# Altium project ECU.PrjPCB
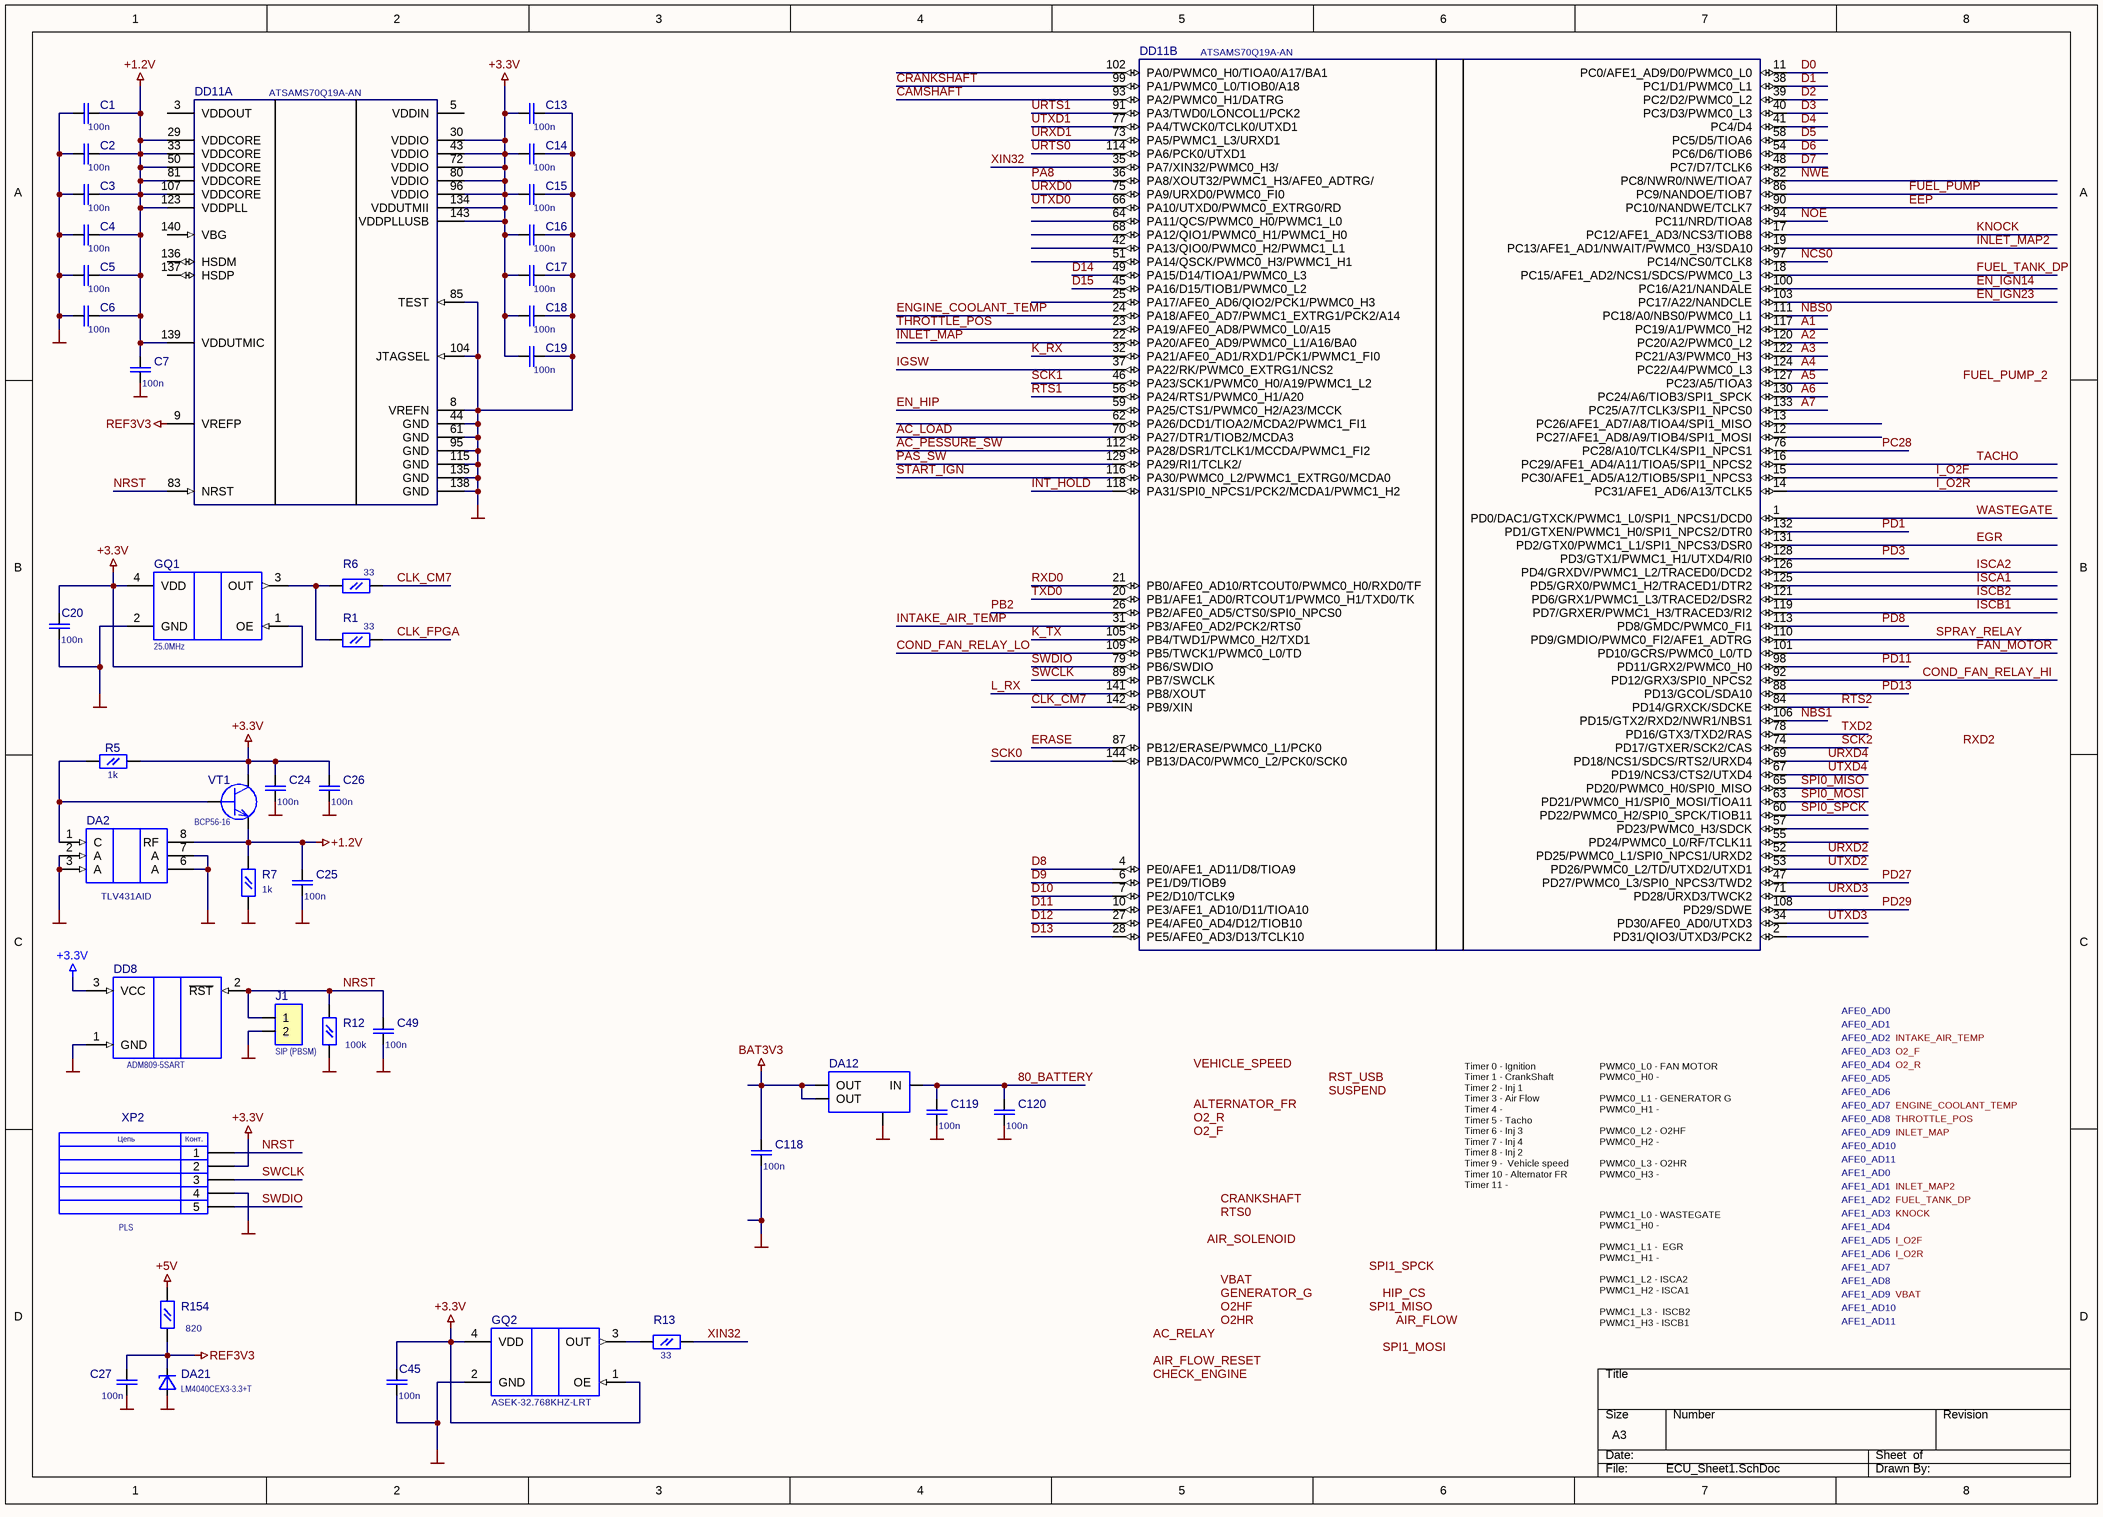
[diagram p0: ECU_Sheet1.SchDoc]
6 sheets, 338 parts. Net scope: global (net labels, ports and power ports of the same name join across sheets).
Board file: ECU.PcbDoc
Sheets:
  ECU_Sheet1.SchDoc
  ECU_Sheet2.SchDoc
  ECU_Sheet3.SchDoc
  ECU_Sheet4.SchDoc
  ECU_Sheet5.SchDoc
  ECU_Sheet6.SchDoc

## Sheet ECU_Sheet1.SchDoc
size A3

### Parts
C1  value 100n  [C0603L]  (hidden comment: 0.1мкФ-25В-X8R-10%)
C2  value 100n  [C0603L]  (hidden comment: 0.1мкФ-25В-X8R-10%)
C3  value 100n  [C0603L]  (hidden comment: 0.1мкФ-25В-X8R-10%)
C4  value 100n  [C0603L]  (hidden comment: 0.1мкФ-25В-X8R-10%)
C5  value 100n  [C0603L]  (hidden comment: 0.1мкФ-25В-X8R-10%)
C6  value 100n  [C0603L]  (hidden comment: 0.1мкФ-25В-X8R-10%)
C7  value 100n  [C0603L]  (hidden comment: 0.1мкФ-25В-X8R-10%)
C13  value 100n  [C0603L]  (hidden comment: 0.1мкФ-25В-X8R-10%)
C14  value 100n  [C0603L]  (hidden comment: 0.1мкФ-25В-X8R-10%)
C15  value 100n  [C0603L]  (hidden comment: 0.1мкФ-25В-X8R-10%)
C16  value 100n  [C0603L]  (hidden comment: 0.1мкФ-25В-X8R-10%)
C17  value 100n  [C0603L]  (hidden comment: 0.1мкФ-25В-X8R-10%)
C18  value 100n  [C0603L]  (hidden comment: 0.1мкФ-25В-X8R-10%)
C19  value 100n  [C0603L]  (hidden comment: 0.1мкФ-25В-X8R-10%)
C20  value 100n  [C0805L]  (hidden comment: 0.01мкФ-50В-X8R-10%)
C24  value 100n  [C0805L]  (hidden comment: 0.1мкФ-25В-X8R-10%)
C25  value 100n  [C0805L]  (hidden comment: 0.1мкФ-25В-X8R-10%)
C26  value 100n  [C0805L]  (hidden comment: 0.1мкФ-25В-X8R-10%)
C27  value 100n  [C0603L]  (hidden comment: 0.1мкФ-25В-X8R-10%)
C45  value 100n  [C0805L]  (hidden comment: 0.01мкФ-50В-X8R-10%)
C49  value 100n  [C0603L]  (hidden comment: 0.1мкФ-25В-X8R-10%)
C118  value 100n  [C0805L]  (hidden comment: 0.1мкФ-25В-X8R-10%)
C119  value 100n  [C0805L]  (hidden comment: CSMD)
C120  value 100n  [C0805L]  (hidden comment: CSMD)
DA2  TLV431AID  [SOIC8 JEDEC]
DA12  LM1117IMP-3.3  [SOT-223]  (value not drawn)
DA21  LM4040CEX3-3.3+T  [SOT-23]
DD8  ADM809-5SART  [SOT-23]
DD11  ATSAMS70Q19A-AN  [LQFP144]  (parts A,B of 2)
GQ1  25.0MHz  [KXO-97]
GQ2  ASEK-32.768KHZ-LRT  [QUARTZ-3.2mm-2.5mm]
J1  SIP (PBSM)  [SIP1X2S]
R1  value 33  [R0603L]  (hidden comment: 33-5%)
R5  value 1k  [R0805]  (hidden comment: 1к-5%)
R6  value 33  [R0603L]  (hidden comment: 33-5%)
R7  value 1k  [R0805L]  (hidden comment: 1к-5%)
R12  value 100k  [R0805L]  (hidden comment: 100к-5%)
R13  value 33  [R0603L]  (hidden comment: 33-5%)
R154  value 820  [R0805L]  (hidden comment: 100к-5%)
VT1  BCP56-16  [SOT-223 PWR]
XP2  PLS  [SIP5]

### Nets
+1.2V: C1.1 C2.1 C3.1 C4.1 C5.1 C6.1 C7.1 C25.1 DA2.8(RF) DD11.29(VDDCORE) DD11.33(VDDCORE) DD11.50(VDDCORE) DD11.81(VDDCORE) DD11.107(VDDCORE) DD11.123(VDDPLL) DD11.139(VDDUTMIC) R7.2(Pin2) VT1.3(E)
+3.3V: C13.2 C14.2 C15.2 C16.2 C17.2 C18.2 C19.2 C20.2 C24.1 C26.1 C45.2 DD8.3(VCC) DD11.30(VDDIO) DD11.43(VDDIO) DD11.72(VDDIO) DD11.80(VDDIO) DD11.96(VDDIO) DD11.134(VDDUTMII) DD11.143(VDDPLLUSB) GQ1.1(OE) GQ1.4(VDD) GQ2.1(OE) GQ2.4(VDD) R5.1(Pin1) VT1.2(C) XP2.2
+5V: R154.2(Pin2)
BAT3V3: C118.1 DA12.2(OUT) DA12.4(OUT)
GND: C1.2 C2.2 C3.2 C4.2 C5.2 C6.2 C7.2 C13.1 C14.1 C15.1 C16.1 C17.1 C18.1 C19.1 C20.1 C24.2 C25.2 C26.2 C27.2 C45.1 C49.2 C118.2 C119.2 C120.2 DA2.2(A) DA2.3(A) DA2.6(A) DA2.7(A) DA12.1(G) DA21.2 DD8.1(GND) DD11.8(VREFN) DD11.44(GND) DD11.61(GND) DD11.85(TEST) DD11.95(GND) DD11.104(JTAGSEL) DD11.115(GND) DD11.135(GND) DD11.138(GND) GQ1.2(GND) GQ2.2(GND) J1.2 R7.1(Pin1) R12.1(Pin1) XP2.4
REF3V3: C27.1 DA21.1 DD11.9(VREFP) R154.1(Pin1)
80_BATTERY: C119.1 C120.1 DA12.3(IN)
A1: DD11.117(PC19/A1/PWMC0_H2)
A2: DD11.120(PC20/A2/PWMC0_L2)
A3: DD11.122(PC21/A3/PWMC0_H3)
A4: DD11.124(PC22/A4/PWMC0_L3)
A5: DD11.127(PC23/A5/TIOA3)
A6: DD11.130(PC24/A6/TIOB3/SPI1_SPCK)
A7: DD11.133(PC25/A7/TCLK3/SPI1_NPCS0)
AC_LOAD: DD11.70(PA27/DTR1/TIOB2/MCDA3)
AC_PESSURE_SW: DD11.112(PA28/DSR1/TCLK1/MCCDA/PWMC1_FI2)
CAMSHAFT: DD11.93(PA2/PWMC0_H1/DATRG)
CLK_CM7: DD11.142(PB9/XIN) R6.2(Pin2)
CLK_FPGA: R1.2(Pin2)
COND_FAN_RELAY_HI: DD11.92(PD12/GRX3/SPI0_NPCS2)
COND_FAN_RELAY_LO: DD11.109(PB5/TWCK1/PWMC0_L0/TD)
CRANKSHAFT: DD11.99(PA1/PWMC0_L0/TIOB0/A18)
D0: DD11.11(PC0/AFE1_AD9/D0/PWMC0_L0)
D1: DD11.38(PC1/D1/PWMC0_L1)
D2: DD11.39(PC2/D2/PWMC0_L2)
D3: DD11.40(PC3/D3/PWMC0_L3)
D4: DD11.41(PC4/D4)
D5: DD11.58(PC5/D5/TIOA6)
D6: DD11.54(PC6/D6/TIOB6)
D7: DD11.48(PC7/D7/TCLK6)
D8: DD11.4(PE0/AFE1_AD11/D8/TIOA9)
D9: DD11.6(PE1/D9/TIOB9)
D10: DD11.7(PE2/D10/TCLK9)
D11: DD11.10(PE3/AFE1_AD10/D11/TIOA10)
D12: DD11.27(PE4/AFE0_AD4/D12/TIOB10)
D13: DD11.28(PE5/AFE0_AD3/D13/TCLK10)
D14: DD11.49(PA15/D14/TIOA1/PWMC0_L3)
D15: DD11.45(PA16/D15/TIOB1/PWMC0_L2)
EEP: DD11.90(PC10/NANDWE/TCLK7)
EGR: DD11.131(PD2/GTX0/PWMC1_L1/SPI1_NPCS3/DSR0)
EN_HIP: DD11.59(PA25/CTS1/PWMC0_H2/A23/MCCK)
EN_IGN14: DD11.100(PC16/A21/NANDALE)
EN_IGN23: DD11.103(PC17/A22/NANDCLE)
ENGINE_COOLANT_TEMP: DD11.24(PA18/AFE0_AD7/PWMC1_EXTRG1/PCK2/A14)
ERASE: DD11.87(PB12/ERASE/PWMC0_L1/PCK0)
FAN_MOTOR: DD11.101(PD10/GCRS/PWMC0_L0/TD)
FUEL_PUMP: DD11.86(PC9/NANDOE/TIOB7)
FUEL_TANK_DP: DD11.18(PC15/AFE1_AD2/NCS1/SDCS/PWMC0_L3)
I_O2F: DD11.15(PC30/AFE1_AD5/A12/TIOB5/SPI1_NPCS3)
I_O2R: DD11.14(PC31/AFE1_AD6/A13/TCLK5)
IGSW: DD11.37(PA22/RK/PWMC0_EXTRG1/NCS2)
INLET_MAP: DD11.22(PA20/AFE0_AD9/PWMC0_L1/A16/BA0)
INLET_MAP2: DD11.19(PC13/AFE1_AD1/NWAIT/PWMC0_H3/SDA10)
INT_HOLD: DD11.118(PA31/SPI0_NPCS1/PCK2/MCDA1/PWMC1_H2)
INTAKE_AIR_TEMP: DD11.31(PB3/AFE0_AD2/PCK2/RTS0)
ISCA1: DD11.125(PD5/GRX0/PWMC1_H2/TRACED1/DTR2)
ISCA2: DD11.126(PD4/GRXDV/PWMC1_L2/TRACED0/DCD2)
ISCB1: DD11.119(PD7/GRXER/PWMC1_H3/TRACED3/RI2)
ISCB2: DD11.121(PD6/GRX1/PWMC1_L3/TRACED2/DSR2)
K_RX: DD11.32(PA21/AFE0_AD1/RXD1/PCK1/PWMC1_FI0)
K_TX: DD11.105(PB4/TWD1/PWMC0_H2/TXD1)
KNOCK: DD11.17(PC12/AFE1_AD3/NCS3/TIOB8)
L_RX: DD11.141(PB8/XOUT)
NBS0: DD11.111(PC18/A0/NBS0/PWMC0_L1)
NBS1: DD11.106(PD15/GTX2/RXD2/NWR1/NBS1)
NCS0: DD11.97(PC14/NCS0/TCLK8)
NOE: DD11.94(PC11/NRD/TIOA8)
NRST: C49.1 DD8.2(~{RST}) DD11.83(NRST) J1.1 R12.2(Pin2) XP2.1
NWE: DD11.82(PC8/NWR0/NWE/TIOA7)
PA8: DD11.36(PA8/XOUT32/PWMC1_H3/AFE0_ADTRG/)
PAS_SW: DD11.129(PA29/RI1/TCLK2/)
PB2: DD11.26(PB2/AFE0_AD5/CTS0/SPI0_NPCS0)
PC28: DD11.76(PC28/A10/TCLK4/SPI1_NPCS1)
PD1: DD11.132(PD1/GTXEN/PWMC1_H0/SPI1_NPCS2/DTR0)
PD3: DD11.128(PD3/GTX1/PWMC1_H1/UTXD4/RI0)
PD8: DD11.113(PD8/GMDC/PWMC0_FI1)
PD11: DD11.98(PD11/GRX2/PWMC0_H0)
PD13: DD11.88(PD13/GCOL/SDA10)
PD27: DD11.47(PD27/PWMC0_L3/SPI0_NPCS3/TWD2)
PD29: DD11.108(PD29/SDWE)
RTS1: DD11.56(PA24/RTS1/PWMC0_H1/A20)
RTS2: DD11.84(PD14/GRXCK/SDCKE)
RXD0: DD11.21(PB0/AFE0_AD10/RTCOUT0/PWMC0_H0/RXD0/TF)
SCK0: DD11.144(PB13/DAC0/PWMC0_L2/PCK0/SCK0)
SCK1: DD11.46(PA23/SCK1/PWMC0_H0/A19/PWMC1_L2)
SCK2: DD11.74(PD17/GTXER/SCK2/CAS)
SPI0_MISO: DD11.65(PD20/PWMC0_H0/SPI0_MISO)
SPI0_MOSI: DD11.63(PD21/PWMC0_H1/SPI0_MOSI/TIOA11)
SPI0_SPCK: DD11.60(PD22/PWMC0_H2/SPI0_SPCK/TIOB11)
SPRAY_RELAY: DD11.110(PD9/GMDIO/PWMC0_FI2/AFE1_ADTRG)
START_IGN: DD11.116(PA30/PWMC0_L2/PWMC1_EXTRG0/MCDA0)
SWCLK: DD11.89(PB7/SWCLK) XP2.3
SWDIO: DD11.79(PB6/SWDIO) XP2.5
TACHO: DD11.16(PC29/AFE1_AD4/A11/TIOA5/SPI1_NPCS2)
THROTTLE_POS: DD11.23(PA19/AFE0_AD8/PWMC0_L0/A15)
TXD0: DD11.20(PB1/AFE1_AD0/RTCOUT1/PWMC0_H1/TXD0/TK)
TXD2: DD11.78(PD16/GTX3/TXD2/RAS)
URTS0: DD11.114(PA6/PCK0/UTXD1)
URTS1: DD11.91(PA3/TWD0/LONCOL1/PCK2)
URXD0: DD11.75(PA9/URXD0/PWMC0_FI0)
URXD1: DD11.73(PA5/PWMC1_L3/URXD1)
URXD2: DD11.52(PD25/PWMC0_L1/SPI0_NPCS1/URXD2)
URXD3: DD11.71(PD28/URXD3/TWCK2)
URXD4: DD11.69(PD18/NCS1/SDCS/RTS2/URXD4)
UTXD0: DD11.66(PA10/UTXD0/PWMC0_EXTRG0/RD)
UTXD1: DD11.77(PA4/TWCK0/TCLK0/UTXD1)
UTXD2: DD11.53(PD26/PWMC0_L2/TD/UTXD2/UTXD1)
UTXD3: DD11.34(PD30/AFE0_AD0/UTXD3)
UTXD4: DD11.67(PD19/NCS3/CTS2/UTXD4)
WASTEGATE: DD11.1(PD0/DAC1/GTXCK/PWMC1_L0/SPI1_NPCS1/DCD0)
XIN32: DD11.35(PA7/XIN32/PWMC0_H3/) R13.2(Pin2)
NetDA2_1: DA2.1(C) R5.2(Pin2) VT1.1(B)
NetGQ1_3: GQ1.3(OUT) R1.1(Pin1) R6.1(Pin1)
NetGQ2_3: GQ2.3(OUT) R13.1(Pin1)

Not connected (* = marked no-connect by the designer): DD11 2(PD31/QIO3/UTXD3/PCK2) 3(VDDOUT) 5(VDDIN) 12(PC27/AFE1_AD8/A9/TIOB4/SPI1_MOSI) 13(PC26/AFE1_AD7/A8/TIOA4/SPI1_MISO) 25(PA17/AFE0_AD6/QIO2/PCK1/PWMC0_H3) 42(PA13/QIO0/PWMC0_H2/PWMC1_L1) 51(PA14/QSCK/PWMC0_H3/PWMC1_H1) 55(PD24/PWMC0_L0/RF/TCLK11) 57(PD23/PWMC0_H3/SDCK) 62(PA26/DCD1/TIOA2/MCDA2/PWMC1_FI1) 64(PA11/QCS/PWMC0_H0/PWMC1_L0) 68(PA12/QIO1/PWMC0_H1/PWMC1_H0) 102(PA0/PWMC0_H0/TIOA0/A17/BA1) 136(HSDM) 137(HSDP) 140(VBG)

### Notes on the sheet
- AFE0_AD0
- AFE0_AD1
- AFE0_AD2
- AFE0_AD3
- AFE0_AD4
- AFE0_AD5
- AFE0_AD6
- AFE0_AD7
- AFE0_AD8
- Timer 0 - Ignition
  Timer 1 - CrankShaft
  Timer 2 - Inj 1
  Timer 3 - Air Flow
  Timer 4 -
  Timer 5 - Tacho
  Timer 6 - Inj 3
  Timer 7 - Inj 4
  Timer 8 - Inj 2
  Timer 9 -  Vehicle speed
  Timer 10 - Alternator FR
  Timer 11 -
- PWMC0_L0 - FAN MOTOR
  PWMC0_H0 -
  PWMC0_L1 - GENERATOR G
  PWMC0_H1 -
  PWMC0_L2 - O2HF
  PWMC0_H2 -
  PWMC0_L3 - O2HR
  PWMC0_H3 -
- AFE0_AD9
- AFE0_AD10
- AFE0_AD11
- AFE1_AD0
- AFE1_AD1
- AFE1_AD2
- AFE1_AD3
- AFE1_AD4
- AFE1_AD5
- AFE1_AD6
- AFE1_AD7
- AFE1_AD8
- AFE1_AD9
- AFE1_AD10
- AFE1_AD11
- PWMC1_L0 - WASTEGATE
  PWMC1_H0 -
  PWMC1_L1 -  EGR
  PWMC1_H1 -
  PWMC1_L2 - ISCA2
  PWMC1_H2 - ISCA1
  PWMC1_L3 -  ISCB2
  PWMC1_H3 - ISCB1
- Labels drawn without touching a wire or pin: AC_RELAY, AIR_FLOW, AIR_FLOW_RESET, AIR_SOLENOID, ALTERNATOR_FR, CHECK_ENGINE, CRANKSHAFT, ENGINE_COOLANT_TEMP, FUEL_PUMP_2, FUEL_TANK_DP, GENERATOR_G, HIP_CS, I_O2F, I_O2R, INLET_MAP, INLET_MAP2, INTAKE_AIR_TEMP, KNOCK, O2_F, O2_R, O2HF, O2HR, RST_USB, RTS0, RXD2, SPI1_MISO, SPI1_MOSI, SPI1_SPCK, SUSPEND, THROTTLE_POS, VBAT, VEHICLE_SPEED
- (in symbol CONNSIP5) Цепь; Конт.

### Library data of the parts
C1-C7 C13-C20 C24-C27 C45 C49 C118-C120 = CSMD: C0603; Voltage: *; Part Field 1: *; Part Field 2: *
DA2 = TL431AID
DA21 = LM4040: Improved Precision Micropower Shunt Voltage Reference
GQ1 = KXO-V97T: KXO-V97T 25.0 MHz; Part Field 1: KXО-V97
GQ2 = ASEMB-8.000MHZ-LY
J1 = CON2: Part Field 2: 2 конт.
R1 R6 R12 R13 R154 = RSMD: R0805; Part Field 1: *; Part Field 2: *
R5 R7 = RSMD: R0805; Part Field 1: 0603; Part Field 2: *
XP2 = CONNSIP5: Value: *; Part Field 2: 5 конт.
DA12 = LM1117IMP-3.3: Value: *
VT1 = BCP56-16: Value: *

## Sheet ECU_Sheet2.SchDoc
size A3
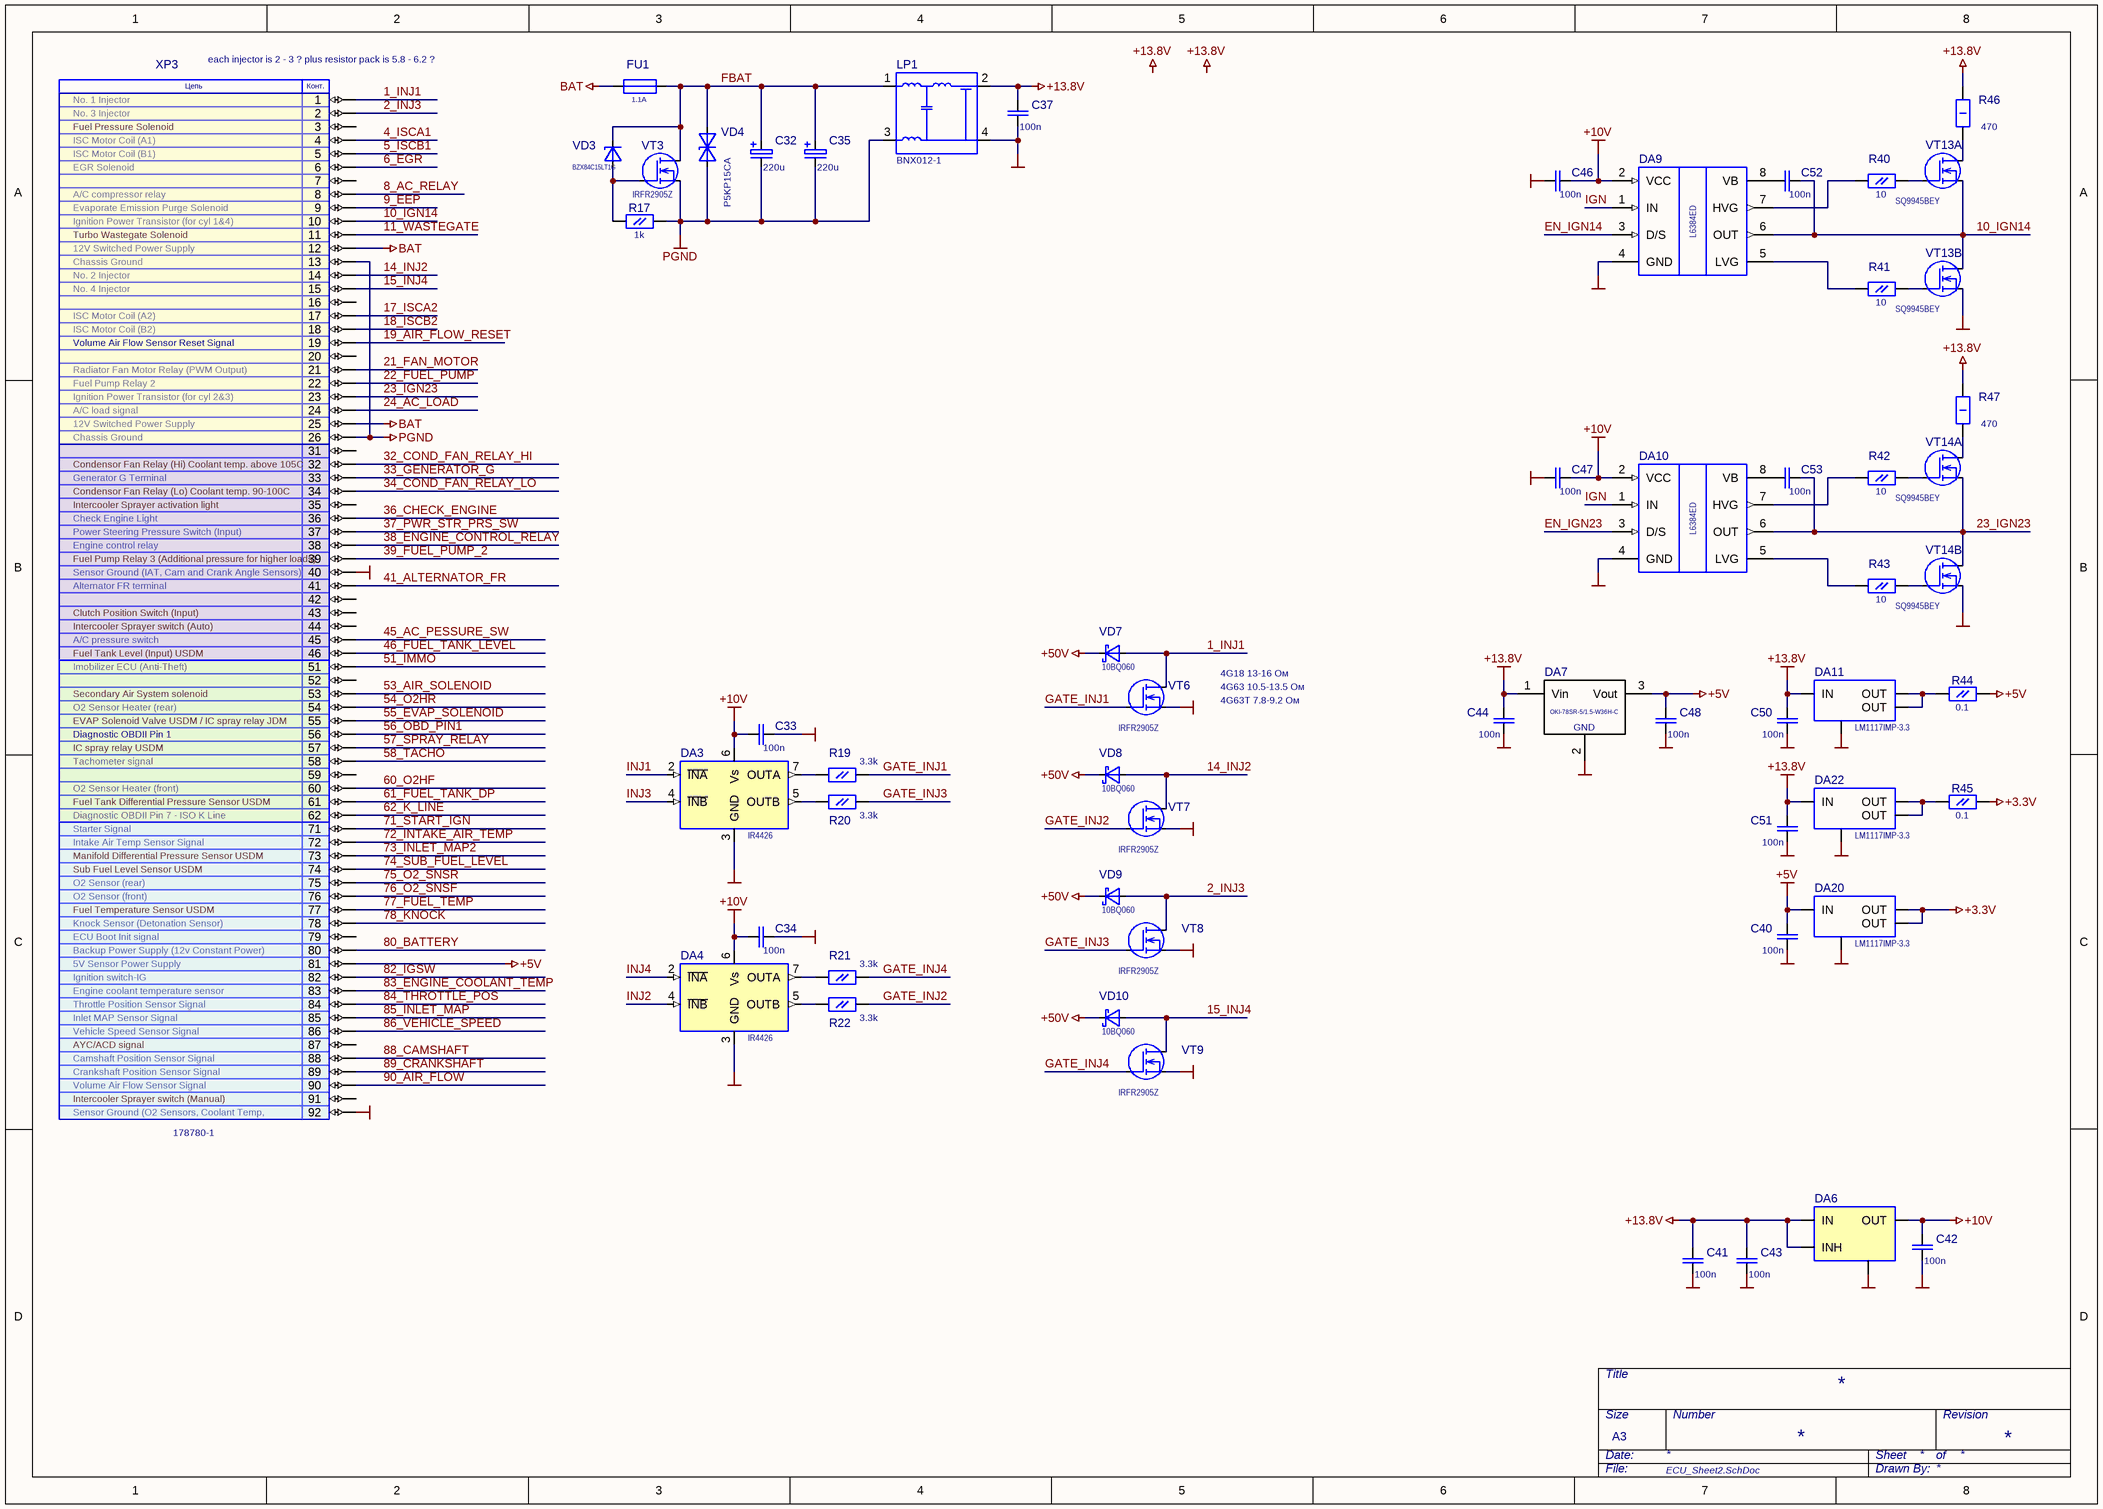
[diagram p1: ECU_Sheet2.SchDoc]

### Parts
C32  value 220u  [C_D_POL]  (hidden comment: CTANT)
C33  value 100n  [C0805L]  (hidden comment: CSMD)
C34  value 100n  [C0805L]  (hidden comment: CSMD)
C35  value 220u  [C_D_POL]  (hidden comment: CTANT)
C37  value 100n  [C0805L]  (hidden comment: 0.1мкФ-25В-X8R-10%)
C40  value 100n  [C0805L]  (hidden comment: CSMD)
C41  value 100n  [C0805L]  (hidden comment: 0.1мкФ-25В-X8R-10%)
C42  value 100n  [C0805L]  (hidden comment: 0.1мкФ-25В-X8R-10%)
C43  value 100n  [C0805L]  (hidden comment: 0.1мкФ-25В-X8R-10%)
C44  value 100n  [C0805L]  (hidden comment: CSMD)
C46  value 100n  [C0805L]  (hidden comment: CSMD)
C47  value 100n  [C0805L]  (hidden comment: CSMD)
C48  value 100n  [C0805L]  (hidden comment: CSMD)
C50  value 100n  [C0805L]  (hidden comment: CSMD)
C51  value 100n  [C0805L]  (hidden comment: CSMD)
C52  value 100n  [C0805L]  (hidden comment: CSMD)
C53  value 100n  [C0805L]  (hidden comment: CSMD)
DA3  IR4426  [SOIC8 JEDEC]
DA4  IR4426  [SOIC8 JEDEC]
DA6  TLE4266GS V10  [SOT-223]  (value not drawn)
DA7  OKI-78SR-5/1.5-W36H-C  [OKI-78SR-H]
DA9  L6384ED  [SOIC8 JEDEC]
DA10  L6384ED  [SOIC8 JEDEC]
DA11  LM1117IMP-3.3  [SOT-223]
DA20  LM1117IMP-3.3  [SOT-223]
DA22  LM1117IMP-3.3  [SOT-223]
FU1  value 1.1A  [FUSE1206]  (hidden comment: MF-NSMF110)
LP1  BNX012-1  [BNX012-01]
R17  value 1k  [R0805L]  (hidden comment: 1к-5%)
R19  value 3.3k  [R0603L]  (hidden comment: RSMD)
R20  value 3.3k  [R0603L]  (hidden comment: RSMD)
R21  value 3.3k  [R0603L]  (hidden comment: RSMD)
R22  value 3.3k  [R0603L]  (hidden comment: RSMD)
R40  value 10  [R0603L]  (hidden comment: RSMD)
R41  value 10  [R0603L]  (hidden comment: RSMD)
R42  value 10  [R0603L]  (hidden comment: RSMD)
R43  value 10  [R0603L]  (hidden comment: RSMD)
R44  value 0.1  [R0805L]  (hidden comment: 1к-5%)
R45  value 0.1  [R0805L]  (hidden comment: 1к-5%)
R46  value 470  [R2512]  (hidden comment: R2512)
R47  value 470  [R2512]  (hidden comment: R2512)
VD3  BZX84C15LT1G  [SOT-23]
VD4  P5KP15CA  [P600]
VD7  10BQ060  [DO-214AA SMB]
VD8  10BQ060  [DO-214AA SMB]
VD9  10BQ060  [DO-214AA SMB]
VD10  10BQ060  [DO-214AA SMB]
VT3  IRFR2905Z  [D-PAK (TO-252)]
VT6  IRFR2905Z  [D-PAK (TO-252)]
VT7  IRFR2905Z  [D-PAK (TO-252)]
VT8  IRFR2905Z  [D-PAK (TO-252)]
VT9  IRFR2905Z  [D-PAK (TO-252)]
VT13  SQ9945BEY  [SOIC8 DBL FET]  (parts A,B of 2)
VT14  SQ9945BEY  [SOIC8 DBL FET]  (parts A,B of 2)
XP3  178780-1  [MITSUBISHI_ECU_CON]

### Nets
+3.3V: DA20.2(OUT) DA20.4(OUT) R45.1(Pin1)
+5V: C40.1 C48.1 DA7.3(Vout) DA20.3(IN) R44.1(Pin1) XP3.81
+10V: C33.2 C34.2 C42.1 C46.1 C47.1 DA3.6(Vs) DA4.6(Vs) DA6.3(OUT) DA9.2(VCC) DA10.2(VCC)
+13.8V: C37.1 C41.1 C43.1 C44.1 C50.1 C51.1 DA6.1(IN) DA6.2(INH) DA7.1(Vin) DA11.3(IN) DA22.3(IN) LP1.2(CB) R46.2(Pin2) R47.2(Pin2)
+50V: VD7.2 VD8.2 VD9.2 VD10.2
BAT: FU1.1 XP3.12 XP3.25
GND: C33.1 C34.1 C37.2 C40.2 C41.2 C42.2 C43.2 C44.2 C46.2 C47.2 C48.2 C50.2 C51.2 DA3.3(GND) DA4.3(GND) DA6.4(GND) DA7.2 DA9.4(GND) DA10.4(GND) DA11.1(G) DA20.1(G) DA22.1(G) LP1.4(CG) VT6.2(S) VT7.2(S) VT8.2(S) VT9.2(S) VT13.3 VT14.3 XP3.40 XP3.92
PGND: C32.N C35.N LP1.3(PSG) R17.1(Pin1) VD4.1 VT3.2(S) XP3.13 XP3.26
1_INJ1: VD7.1 VT6.3(D) XP3.1
2_INJ3: VD9.1 VT8.3(D) XP3.2
4_ISCA1: XP3.4
5_ISCB1: XP3.5
6_EGR: XP3.6
8_AC_RELAY: XP3.8
9_EEP: XP3.9
10_IGN14: C52.1 DA9.6(OUT) VT13.1 VT13.5 XP3.10
11_WASTEGATE: XP3.11
14_INJ2: VD8.1 VT7.3(D) XP3.14
15_INJ4: VD10.1 VT9.3(D) XP3.15
17_ISCA2: XP3.17
18_ISCB2: XP3.18
19_AIR_FLOW_RESET: XP3.19
21_FAN_MOTOR: XP3.21
22_FUEL_PUMP: XP3.22
23_IGN23: C53.1 DA10.6(OUT) VT14.1 VT14.5 XP3.23
24_AC_LOAD: XP3.24
32_COND_FAN_RELAY_HI: XP3.32
33_GENERATOR_G: XP3.33
34_COND_FAN_RELAY_LO: XP3.34
36_CHECK_ENGINE: XP3.36
37_PWR_STR_PRS_SW: XP3.37
38_ENGINE_CONTROL_RELAY: XP3.38
39_FUEL_PUMP_2: XP3.39
41_ALTERNATOR_FR: XP3.41
45_AC_PESSURE_SW: XP3.45
46_FUEL_TANK_LEVEL: XP3.46
51_IMMO: XP3.51
53_AIR_SOLENOID: XP3.53
54_O2HR: XP3.54
55_EVAP_SOLENOID: XP3.55
56_OBD_PIN1: XP3.56
57_SPRAY_RELAY: XP3.57
58_TACHO: XP3.58
60_O2HF: XP3.60
61_FUEL_TANK_DP: XP3.61
62_K_LINE: XP3.62
71_START_IGN: XP3.71
72_INTAKE_AIR_TEMP: XP3.72
73_INLET_MAP2: XP3.73
74_SUB_FUEL_LEVEL: XP3.74
75_O2_SNSR: XP3.75
76_O2_SNSF: XP3.76
77_FUEL_TEMP: XP3.77
78_KNOCK: XP3.78
80_BATTERY: XP3.80
82_IGSW: XP3.82
83_ENGINE_COOLANT_TEMP: XP3.83
84_THROTTLE_POS: XP3.84
85_INLET_MAP: XP3.85
86_VEHICLE_SPEED: XP3.86
88_CAMSHAFT: XP3.88
89_CRANKSHAFT: XP3.89
90_AIR_FLOW: XP3.90
EN_IGN14: DA9.3(D/S)
EN_IGN23: DA10.3(D/S)
FBAT: C32.P C35.P FU1.2 LP1.1(B) VD3.3 VD4.2 VT3.3(D)
GATE_INJ1: R19.2(Pin2) VT6.1(G)
GATE_INJ2: R22.2(Pin2) VT7.1(G)
GATE_INJ3: R20.2(Pin2) VT8.1(G)
GATE_INJ4: R21.2(Pin2) VT9.1(G)
IGN: DA9.1(IN) DA10.1(IN)
INJ1: DA3.2(~{INA})
INJ2: DA4.4(~{INB})
INJ3: DA3.4(~{INB})
INJ4: DA4.2(~{INA})
NetC52_2: C52.2 DA9.8(VB)
NetC53_2: C53.2 DA10.8(VB)
NetDA3_5: DA3.5(OUTB) R20.1(Pin1)
NetDA3_7: DA3.7(OUTA) R19.1(Pin1)
NetDA4_5: DA4.5(OUTB) R22.1(Pin1)
NetDA4_7: DA4.7(OUTA) R21.1(Pin1)
NetDA9_5: DA9.5(LVG) R41.1(Pin1)
NetDA9_7: DA9.7(HVG) R40.1(Pin1)
NetDA10_5: DA10.5(LVG) R43.1(Pin1)
NetDA10_7: DA10.7(HVG) R42.1(Pin1)
NetDA11_2: DA11.2(OUT) DA11.4(OUT) R44.2(Pin2)
NetDA22_2: DA22.2(OUT) DA22.4(OUT) R45.2(Pin2)
NetR17_2: R17.2(Pin2) VD3.1 VT3.1(G)
NetR40_2: R40.2(Pin2) VT13.2
NetR41_2: R41.2(Pin2) VT13.4
NetR42_2: R42.2(Pin2) VT14.2
NetR43_2: R43.2(Pin2) VT14.4
NetR46_1: R46.1(Pin1) VT13.6
NetR47_1: R47.1(Pin1) VT14.6

Not connected (* = marked no-connect by the designer): LP1 5 6; XP3 3 7 16 20 31 35 42 43 44 52 59 79 87 91

### Notes on the sheet
- No. 1 Injector
- No. 3 Injector
- (near XP3) each injector is 2 - 3 ? plus resistor pack is 5.8 - 6.2 ?
- ISC Motor Coil (A1)
- ISC Motor Coil (B1)
- EGR Solenoid
- Fuel Pressure Solenoid
- A/C compressor relay
- Evaporate Emission Purge Solenoid
- Ignition Power Transistor (for cyl 1&4)
- 12V Switched Power Supply
- Turbo Wastegate Solenoid
- No. 2 Injector
- No. 4 Injector
- ISC Motor Coil (A2)
- Chassis Ground
- ISC Motor Coil (B2)
- Radiator Fan Motor Relay (PWM Output)
- Fuel Pump Relay 2
- Volume Air Flow Sensor Reset Signal
- Ignition Power Transistor (for cyl 2&3)
- A/C load signal
- Generator G Terminal
- Check Engine Light
- Intercooler Sprayer activation light
- (near XP3) Condensor Fan Relay (Lo) Coolant temp. 90-100C
- (near XP3) Condensor Fan Relay (Hi) Coolant temp. above 105C
- Power Steering Pressure Switch (Input)
- Engine control relay
- (near XP3) Sensor Ground (IAT, Cam and Crank Angle Sensors)
- Alternator FR terminal
- (near XP3) Fuel Pump Relay 3 (Additional pressure for higher loads)
- A/C pressure switch
- Fuel Tank Level (Input) USDM
- Intercooler Sprayer switch (Auto)
- Clutch Position Switch (Input)
- Imobilizer ECU (Anti-Theft)
- O2 Sensor Heater (rear)
- (near XP3) EVAP Solenoid Valve USDM / IC spray relay JDM
- Secondary Air System solenoid
- 4G18 13-16 Ом
- 4G63T 7.8-9.2 Ом
- 4G63 10.5-13.5 Ом
- Tachometer signal
- O2 Sensor Heater (front)
- Diagnostic OBDII Pin 1
- IC spray relay USDM
- Diagnostic OBDII Pin 7 - ISO K Line
- Starter Signal
- Intake Air Temp Sensor Signal
- (near XP3) Manifold Differential Pressure Sensor USDM
- (near XP3) Fuel Tank Differential Pressure Sensor USDM
- O2 Sensor (rear)
- O2 Sensor (front)
- Knock Sensor (Detonation Sensor)
- Fuel Temperature Sensor USDM
- Sub Fuel Level Sensor USDM
- ECU Boot Init signal
- Backup Power Supply (12v Constant Power)
- 5V Sensor Power Supply
- Ignition switch-IG
- Engine coolant temperature sensor
- Throttle Position Sensor Signal
- Inlet MAP Sensor Signal
- Vehicle Speed Sensor Signal
- Camshaft Position Sensor Signal
- AYC/ACD signal
- Volume Air Flow Sensor Signal
- Crankshaft Position Sensor Signal
- Sensor Ground (O2 Sensors, Coolant Temp,
- Intercooler Sprayer switch (Manual)
- Labels drawn without touching a wire or pin: +13.8V
- Title
- Date:
- Size
- A3
- Number
- Sheet
- of
- Revision
- File:
- Drawn By:
- (in symbol MITSUBISHI_ECU_CON) Цепь; Конт.
- (in symbol OKI-78SR) GND

### Library data of the parts
C32 C35 = CTANT: 220 mkF  25 v (корпус Е (4,4х7мм))  20% smd   Танталовый    ЧИП    227M025V; Part Field 1: *; Part Field 2: *
C33 C34 C37 C40-C44 C46-C48 C50-C53 = CSMD: C0603; Voltage: *; Part Field 1: *; Part Field 2: *
DA6 = TLE4266G: Value: *
DA7 = OKI-78SR: Fixed Output 1.5 Amp SIP DC/DC Converter
FU1 = MF-NSMF012
R17 R44 R45 = RSMD: R0805; Part Field 1: 0603; Part Field 2: *
R19-R22 R40-R43 = RSMD: R0805; Part Field 1: *; Part Field 2: *
VD3 = BZX84C36: Value: *
VT3 VT6-VT9 = SPD02N80C3: MOSFET 55V , 42A , 0.011 Om; OriginalName: 2N4124; ComponentField6: Published 8-Jun-2000, Modified 11-July-2000: SIM Model Added.; Value: *
XP3 = MITSUBISHI_ECU_CON: TE 178780-1; Value: *
DA3 DA4 = IR4426: Part Field 1: *; Part Field 2: *
DA11 DA20 DA22 = LM1117IMP-3.3: Value: *
LP1 = BNX012-1: Value: *
VD7-VD10 = 10BQ060: Value: *

## Sheet ECU_Sheet3.SchDoc
size A3
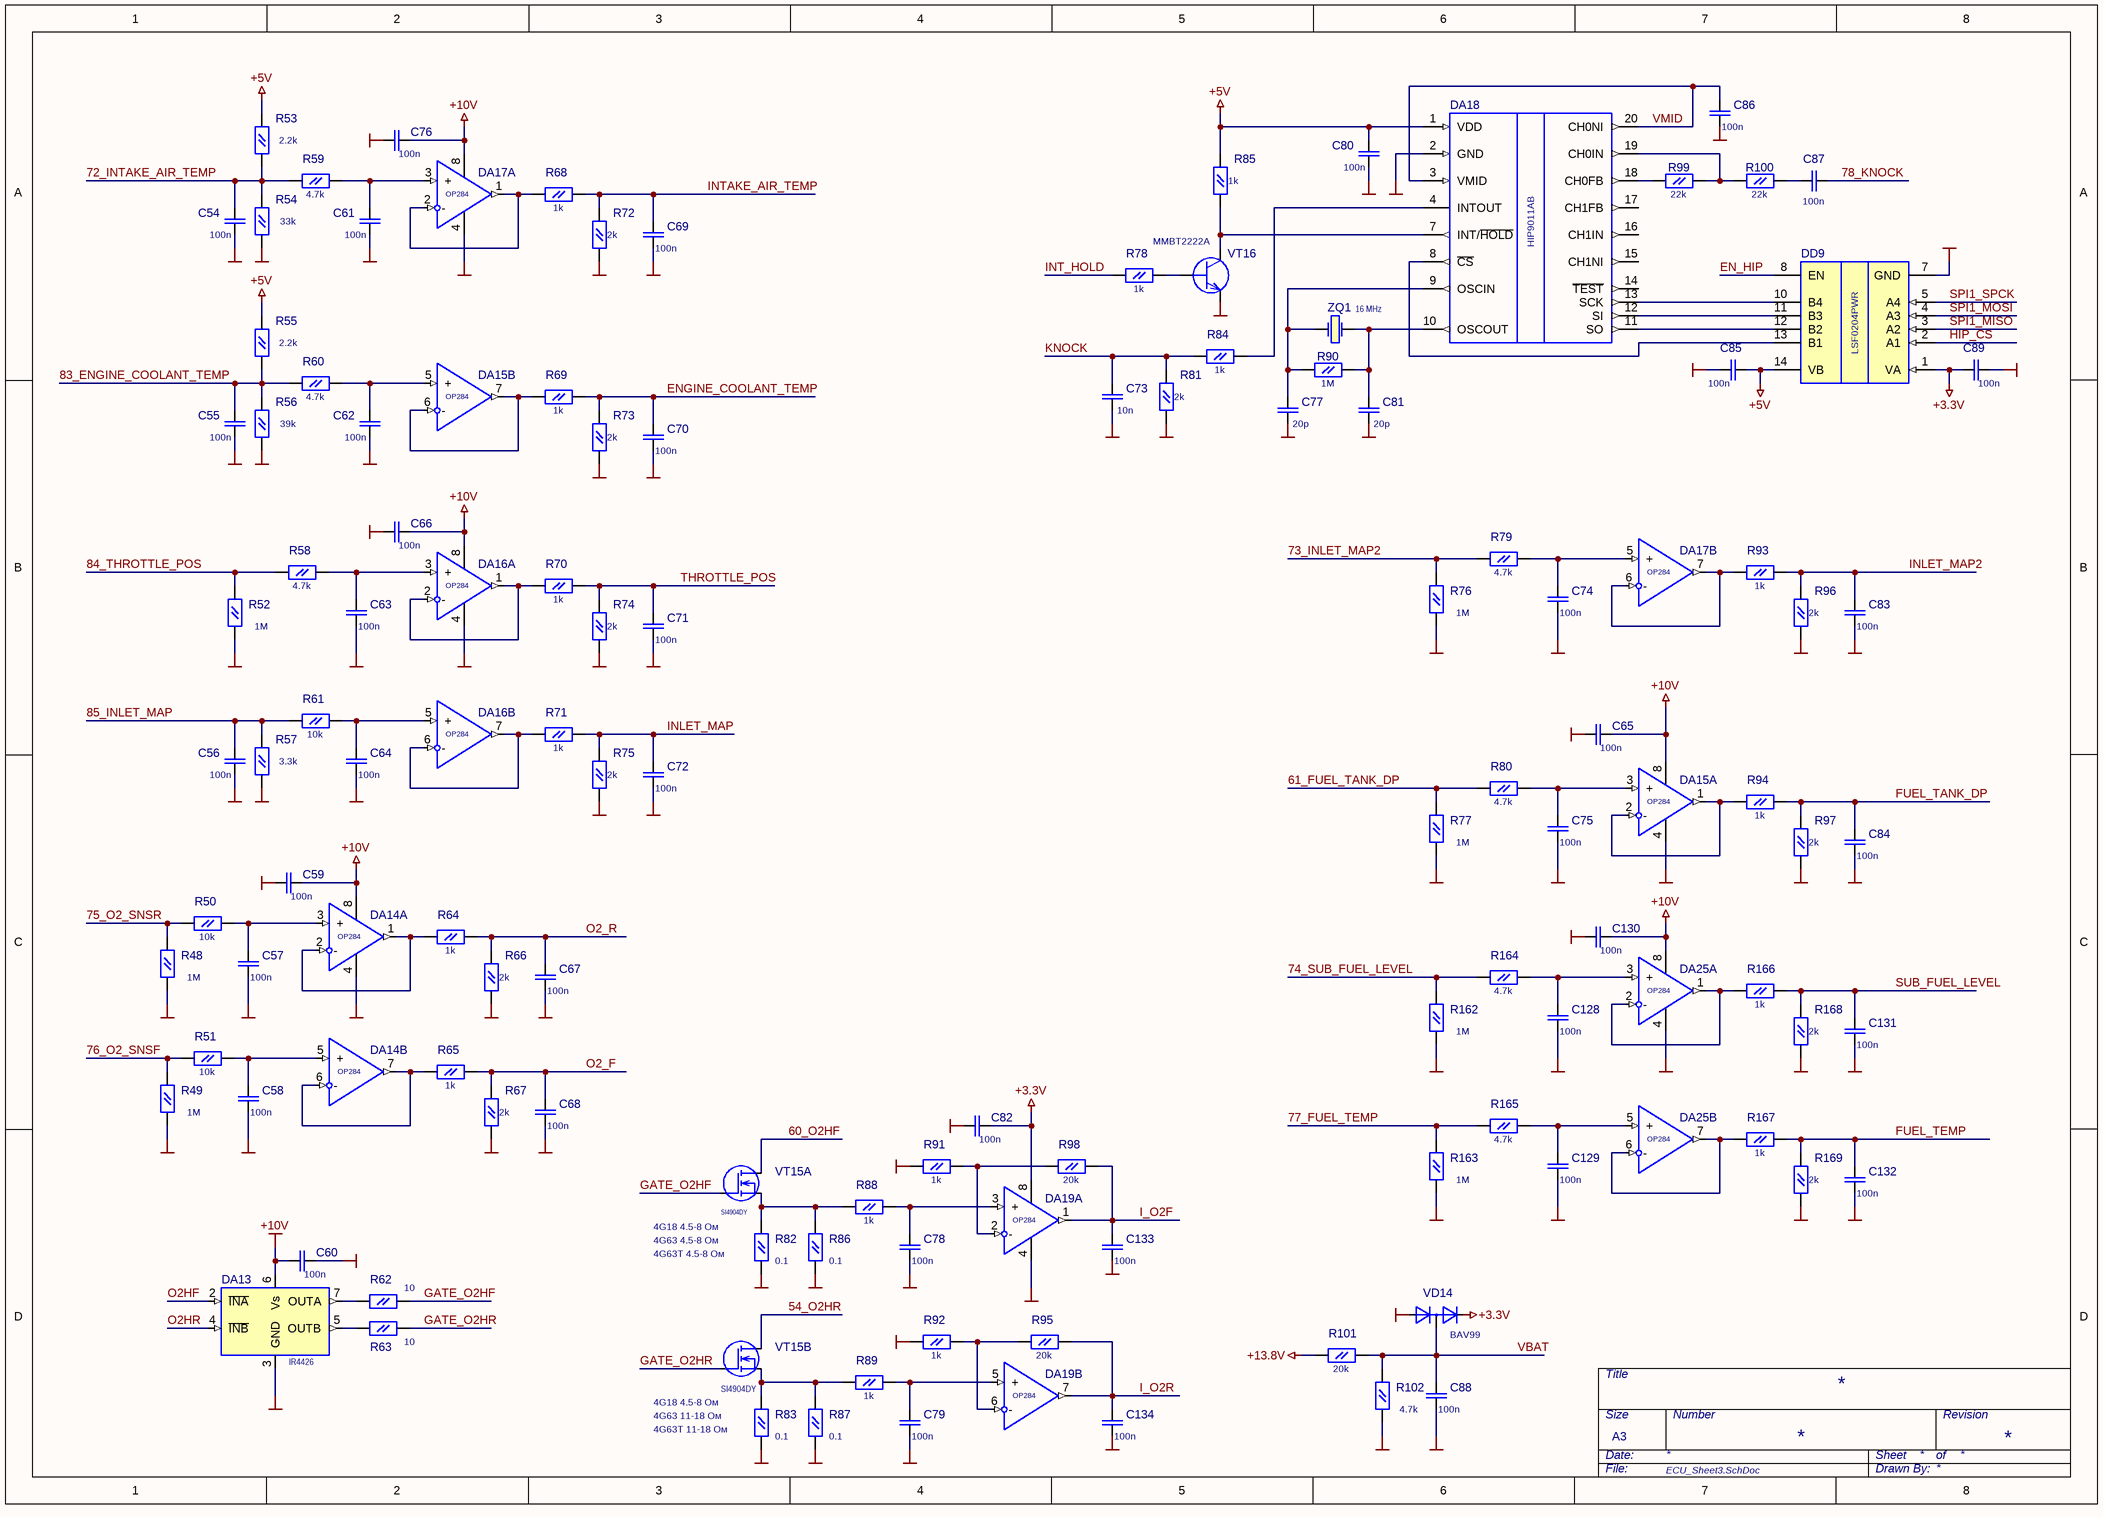
[diagram p2: ECU_Sheet3.SchDoc]

### Parts
C54  value 100n  [C0805L]  (hidden comment: CSMD)
C55  value 100n  [C0805L]  (hidden comment: CSMD)
C56  value 100n  [C0805L]  (hidden comment: CSMD)
C57  value 100n  [C0805L]  (hidden comment: CSMD)
C58  value 100n  [C0805L]  (hidden comment: CSMD)
C59  value 100n  [C0805L]  (hidden comment: CSMD)
C60  value 100n  [C0805L]  (hidden comment: CSMD)
C61  value 100n  [C0805L]  (hidden comment: CSMD)
C62  value 100n  [C0805L]  (hidden comment: CSMD)
C63  value 100n  [C0805L]  (hidden comment: CSMD)
C64  value 100n  [C0805L]  (hidden comment: CSMD)
C65  value 100n  [C0805L]  (hidden comment: CSMD)
C66  value 100n  [C0805L]  (hidden comment: CSMD)
C67  value 100n  [C0603L]  (hidden comment: CSMD)
C68  value 100n  [C0603L]  (hidden comment: CSMD)
C69  value 100n  [C0603L]  (hidden comment: CSMD)
C70  value 100n  [C0603L]  (hidden comment: CSMD)
C71  value 100n  [C0603L]  (hidden comment: CSMD)
C72  value 100n  [C0603L]  (hidden comment: CSMD)
C73  value 10n  [C0603L]  (hidden comment: CSMD)
C74  value 100n  [C0805L]  (hidden comment: CSMD)
C75  value 100n  [C0805L]  (hidden comment: CSMD)
C76  value 100n  [C0805L]  (hidden comment: CSMD)
C77  value 20p  [C0805L]  (hidden comment: CSMD)
C78  value 100n  [C0805L]  (hidden comment: CSMD)
C79  value 100n  [C0805L]  (hidden comment: CSMD)
C80  value 100n  [C0805L]  (hidden comment: CSMD)
C81  value 20p  [C0805L]  (hidden comment: CSMD)
C82  value 100n  [C0805L]  (hidden comment: CSMD)
C83  value 100n  [C0603L]  (hidden comment: CSMD)
C84  value 100n  [C0603L]  (hidden comment: CSMD)
C85  value 100n  [C0805L]  (hidden comment: CSMD)
C86  value 100n  [C0805L]  (hidden comment: CSMD)
C87  value 100n  [C0805L]  (hidden comment: CSMD)
C88  value 100n  [C0603L]  (hidden comment: CSMD)
C89  value 100n  [C0805L]  (hidden comment: CSMD)
C128  value 100n  [C0805L]  (hidden comment: CSMD)
C129  value 100n  [C0805L]  (hidden comment: CSMD)
C130  value 100n  [C0805L]  (hidden comment: CSMD)
C131  value 100n  [C0603L]  (hidden comment: CSMD)
C132  value 100n  [C0603L]  (hidden comment: CSMD)
C133  value 100n  [C0603L]  (hidden comment: CSMD)
C134  value 100n  [C0603L]  (hidden comment: CSMD)
DA13  IR4426  [SOIC8 JEDEC]
DA14  OP284  [SOIC8 JEDEC]  (parts A,B of 2)
DA15  OP284  [SOIC8 JEDEC]  (parts A,B of 2)
DA16  OP284  [SOIC8 JEDEC]  (parts A,B of 2)
DA17  OP284  [SOIC8 JEDEC]  (parts A,B of 2)
DA18  HIP9011AB  [SOIC-20 (JEDEC MS-013-AC)]
DA19  OP284  [SOIC8 JEDEC]  (parts A,B of 2)
DA25  OP284  [SOIC8 JEDEC]  (parts A,B of 2)
DD9  LSF0204PWR  [TSSOP14 (JEDEC MO-153)]
R48  value 1M  [R0805L]  (hidden comment: RSMD)
R49  value 1M  [R0805L]  (hidden comment: RSMD)
R50  value 10k  [R0805L]  (hidden comment: RSMD)
R51  value 10k  [R0805L]  (hidden comment: RSMD)
R52  value 1M  [R0805L]  (hidden comment: RSMD)
R53  value 2.2k  [R0805L]  (hidden comment: RSMD)
R54  value 33k  [R0805L]  (hidden comment: RSMD)
R55  value 2.2k  [R0805L]  (hidden comment: RSMD)
R56  value 39k  [R0805L]  (hidden comment: RSMD)
R57  value 3.3k  [R0805L]  (hidden comment: RSMD)
R58  value 4.7k  [R0805L]  (hidden comment: RSMD)
R59  value 4.7k  [R0805L]  (hidden comment: RSMD)
R60  value 4.7k  [R0805L]  (hidden comment: RSMD)
R61  value 10k  [R0805L]  (hidden comment: RSMD)
R62  value 10  [R0603L]  (hidden comment: RSMD)
R63  value 10  [R0603L]  (hidden comment: RSMD)
R64  value 1k  [R0805L]  (hidden comment: RSMD)
R65  value 1k  [R0805L]  (hidden comment: RSMD)
R66  value 2k  [R0805L]  (hidden comment: RSMD)
R67  value 2k  [R0805L]  (hidden comment: RSMD)
R68  value 1k  [R0805L]  (hidden comment: RSMD)
R69  value 1k  [R0805L]  (hidden comment: RSMD)
R70  value 1k  [R0805L]  (hidden comment: RSMD)
R71  value 1k  [R0805L]  (hidden comment: RSMD)
R72  value 2k  [R0805L]  (hidden comment: RSMD)
R73  value 2k  [R0805L]  (hidden comment: RSMD)
R74  value 2k  [R0805L]  (hidden comment: RSMD)
R75  value 2k  [R0805L]  (hidden comment: RSMD)
R76  value 1M  [R0805L]  (hidden comment: RSMD)
R77  value 1M  [R0805L]  (hidden comment: RSMD)
R78  value 1k  [R0805L]  (hidden comment: RSMD)
R79  value 4.7k  [R0805L]  (hidden comment: RSMD)
R80  value 4.7k  [R0805L]  (hidden comment: RSMD)
R81  value 2k  [R0805L]  (hidden comment: RSMD)
R82  value 0.1  [R0805L]  (hidden comment: RSMD)
R83  value 0.1  [R0805L]  (hidden comment: RSMD)
R84  value 1k  [R0805L]  (hidden comment: RSMD)
R85  value 1k  [R0805L]  (hidden comment: RSMD)
R86  value 0.1  [R0805L]  (hidden comment: RSMD)
R87  value 0.1  [R0805L]  (hidden comment: RSMD)
R88  value 1k  [R0805L]  (hidden comment: RSMD)
R89  value 1k  [R0805L]  (hidden comment: RSMD)
R90  value 1M  [R0805L]  (hidden comment: RSMD)
R91  value 1k  [R0805L]  (hidden comment: RSMD)
R92  value 1k  [R0805L]  (hidden comment: RSMD)
R93  value 1k  [R0805L]  (hidden comment: RSMD)
R94  value 1k  [R0805L]  (hidden comment: RSMD)
R95  value 20k  [R0805L]  (hidden comment: RSMD)
R96  value 2k  [R0805L]  (hidden comment: RSMD)
R97  value 2k  [R0805L]  (hidden comment: RSMD)
R98  value 20k  [R0805L]  (hidden comment: RSMD)
R99  value 22k  [R0805L]  (hidden comment: RSMD)
R100  value 22k  [R0805L]  (hidden comment: RSMD)
R101  value 20k  [R0805L]  (hidden comment: RSMD)
R102  value 4.7k  [R0805L]  (hidden comment: RSMD)
R162  value 1M  [R0805L]  (hidden comment: RSMD)
R163  value 1M  [R0805L]  (hidden comment: RSMD)
R164  value 4.7k  [R0805L]  (hidden comment: RSMD)
R165  value 4.7k  [R0805L]  (hidden comment: RSMD)
R166  value 1k  [R0805L]  (hidden comment: RSMD)
R167  value 1k  [R0805L]  (hidden comment: RSMD)
R168  value 2k  [R0805L]  (hidden comment: RSMD)
R169  value 2k  [R0805L]  (hidden comment: RSMD)
VD14  BAV99  [SOT-23]
VT15  SI4904DY  [SOIC8 DBL FET]  (parts A,B of 2)
VT16  MMBT2222A  [SOT-23_MMBT2222A(Primary)]
ZQ1  16 MHz  [HC-49/S]

### Nets
+3.3V: C82.1 C89.2 DA19.8(V+) DD9.1(VA) VD14.2(K)
+5V: C80.2 C85.2 DA18.1(VDD) DD9.14(VB) R53.2(Pin2) R55.2(Pin2) R85.2(Pin2)
+10V: C59.1 C60.2 C65.1 C66.1 C76.1 C130.1 DA13.6(Vs) DA14.8(V+) DA15.8(V+) DA16.8(V+) DA17.8(V+) DA25.8(V+)
+13.8V: R101.1(Pin1)
GND: C54.2 C55.2 C56.2 C57.2 C58.2 C59.2 C60.1 C61.2 C62.2 C63.2 C64.2 C65.2 C66.2 C67.2 C68.2 C69.2 C70.2 C71.2 C72.2 C73.2 C74.2 C75.2 C76.2 C77.2 C78.2 C79.2 C80.1 C81.2 C82.2 C83.2 C84.2 C85.1 C86.2 C88.2 C89.1 C128.2 C129.2 C130.2 C131.2 C132.2 C133.2 C134.2 DA13.3(GND) DA14.4(V-) DA15.4(V-) DA16.4(V-) DA17.4(V-) DA18.2(GND) DA19.4(V-) DA25.4(V-) DD9.7(GND) R48.1(Pin1) R49.1(Pin1) R52.1(Pin1) R54.1(Pin1) R56.1(Pin1) R57.1(Pin1) R66.1(Pin1) R67.1(Pin1) R72.1(Pin1) R73.1(Pin1) R74.1(Pin1) R75.1(Pin1) R76.1(Pin1) R77.1(Pin1) R81.1(Pin1) R82.2(Pin2) R83.2(Pin2) R86.2(Pin2) R87.2(Pin2) R91.1(Pin1) R92.1(Pin1) R96.1(Pin1) R97.1(Pin1) R102.1(Pin1) R162.1(Pin1) R163.1(Pin1) R168.1(Pin1) R169.1(Pin1) VD14.1(A) VT16.3(E)
54_O2HR: VT15.5
60_O2HF: VT15.6
61_FUEL_TANK_DP: R77.2(Pin2) R80.1(Pin1)
72_INTAKE_AIR_TEMP: C54.1 R53.1(Pin1) R54.2(Pin2) R59.1(Pin1)
73_INLET_MAP2: R76.2(Pin2) R79.1(Pin1)
74_SUB_FUEL_LEVEL: R162.2(Pin2) R164.1(Pin1)
75_O2_SNSR: R48.2(Pin2) R50.1(Pin1)
76_O2_SNSF: R49.2(Pin2) R51.1(Pin1)
77_FUEL_TEMP: R163.2(Pin2) R165.1(Pin1)
78_KNOCK: C87.2
83_ENGINE_COOLANT_TEMP: C55.1 R55.1(Pin1) R56.2(Pin2) R60.1(Pin1)
84_THROTTLE_POS: R52.2(Pin2) R58.1(Pin1)
85_INLET_MAP: C56.1 R57.2(Pin2) R61.1(Pin1)
EN_HIP: DD9.8(EN)
ENGINE_COOLANT_TEMP: C70.1 R69.2(Pin2) R73.2(Pin2)
FUEL_TANK_DP: C84.1 R94.2(Pin2) R97.2(Pin2)
FUEL_TEMP: C132.1 R167.2(Pin2) R169.2(Pin2)
GATE_O2HF: R62.2(Pin2) VT15.2
GATE_O2HR: R63.2(Pin2) VT15.4
HIP_CS: DD9.2(A1)
I_O2F: C133.1 DA19.1(OUT) R98.2(Pin2)
I_O2R: C134.1 DA19.7(OUT) R95.2(Pin2)
INLET_MAP: C72.1 R71.2(Pin2) R75.2(Pin2)
INLET_MAP2: C83.1 R93.2(Pin2) R96.2(Pin2)
INT_HOLD: R78.1(Pin1)
INTAKE_AIR_TEMP: C69.1 R68.2(Pin2) R72.2(Pin2)
KNOCK: C73.1 R81.2(Pin2) R84.1(Pin1)
O2_F: C68.1 R65.2(Pin2) R67.2(Pin2)
O2_R: C67.1 R64.2(Pin2) R66.2(Pin2)
O2HF: DA13.2(~{INA})
O2HR: DA13.4(~{INB})
SPI1_MISO: DD9.3(A2)
SPI1_MOSI: DD9.4(A3)
SPI1_SPCK: DD9.5(A4)
SUB_FUEL_LEVEL: C131.1 R166.2(Pin2) R168.2(Pin2)
THROTTLE_POS: C71.1 R70.2(Pin2) R74.2(Pin2)
VBAT: C88.1 R101.2(Pin2) R102.2(Pin2) VD14.3(C)
VMID: C86.1 DA18.3(VMID) DA18.20(CH0NI)
NetC57_1: C57.1 DA14.3(+) R50.2(Pin2)
NetC58_1: C58.1 DA14.5(+) R51.2(Pin2)
NetC61_1: C61.1 DA17.3(+) R59.2(Pin2)
NetC62_1: C62.1 DA15.5(+) R60.2(Pin2)
NetC63_1: C63.1 DA16.3(+) R58.2(Pin2)
NetC64_1: C64.1 DA16.5(+) R61.2(Pin2)
NetC74_1: C74.1 DA17.5(+) R79.2(Pin2)
NetC75_1: C75.1 DA15.3(+) R80.2(Pin2)
NetC77_1: C77.1 DA18.9(OSCIN) R90.1(Pin1) ZQ1.1
NetC78_1: C78.1 DA19.3(+) R88.2(Pin2)
NetC79_1: C79.1 DA19.5(+) R89.2(Pin2)
NetC81_1: C81.1 DA18.10(OSCOUT) R90.2(Pin2) ZQ1.2
NetC87_1: C87.1 R100.2(Pin2)
NetC128_1: C128.1 DA25.3(+) R164.2(Pin2)
NetC129_1: C129.1 DA25.5(+) R165.2(Pin2)
NetDA13_5: DA13.5(OUTB) R63.1(Pin1)
NetDA13_7: DA13.7(OUTA) R62.1(Pin1)
NetDA14_1: DA14.1(OUT) DA14.2(-) R64.1(Pin1)
NetDA14_6: DA14.6(-) DA14.7(OUT) R65.1(Pin1)
NetDA15_1: DA15.1(OUT) DA15.2(-) R94.1(Pin1)
NetDA15_6: DA15.6(-) DA15.7(OUT) R69.1(Pin1)
NetDA16_1: DA16.1(OUT) DA16.2(-) R70.1(Pin1)
NetDA16_6: DA16.6(-) DA16.7(OUT) R71.1(Pin1)
NetDA17_1: DA17.1(OUT) DA17.2(-) R68.1(Pin1)
NetDA17_6: DA17.6(-) DA17.7(OUT) R93.1(Pin1)
NetDA18_4: DA18.4(INTOUT) R84.2(Pin2)
NetDA18_7: DA18.7(INT/~{HOLD}) R85.1(Pin1) VT16.1(C)
NetDA18_8: DA18.8(~{CS}) DD9.13(B1)
NetDA18_11: DA18.11(SO) DD9.12(B2)
NetDA18_12: DA18.12(SI) DD9.11(B3)
NetDA18_13: DA18.13(SCK) DD9.10(B4)
NetDA18_18: DA18.18(CH0FB) R99.1(Pin1)
NetDA18_19: DA18.19(CH0IN) R99.2(Pin2) R100.1(Pin1)
NetDA19_2: DA19.2(-) R91.2(Pin2) R98.1(Pin1)
NetDA19_6: DA19.6(-) R92.2(Pin2) R95.1(Pin1)
NetDA25_1: DA25.1(OUT) DA25.2(-) R166.1(Pin1)
NetDA25_6: DA25.6(-) DA25.7(OUT) R167.1(Pin1)
NetR78_2: R78.2(Pin2) VT16.2(B)
NetR82_1: R82.1(Pin1) R86.1(Pin1) R88.1(Pin1) VT15.1
NetR83_1: R83.1(Pin1) R87.1(Pin1) R89.1(Pin1) VT15.3

Not connected (* = marked no-connect by the designer): DA18 14(~{TEST}) 15(CH1NI) 16(CH1IN) 17(CH1FB)

### Notes on the sheet
- 4G18 4.5-8 Ом
- 4G63 4.5-8 Ом
- 4G63T 4.5-8 Ом
- 4G63 11-18 Ом
- 4G63T 11-18 Ом
- Title
- Date:
- Size
- A3
- Number
- Sheet
- of
- Revision
- File:
- Drawn By:

### Library data of the parts
C54-C89 C128-C134 = CSMD: C0603; Voltage: *; Part Field 1: *; Part Field 2: *
DA14-DA17 DA19 DA25 = AD822: Value: *
R48-R102 R162-R169 = RSMD: R0805
  R62 R63 R82 R83 R86 R87: Part Field 1: *; Part Field 2: *
VT15 = SQ9945BEY: SI4904DY или IRF7341TRPBF или SI4908DY
ZQ1 = QUARZ: KX-3НЕ-16.0 MHz; Part Field 1: HC-49S
DA13 = IR4426: Part Field 1: *; Part Field 2: *
VD14 = BAV99: Value: *
VT16 = MMBT2222A: Value: *

## Sheet ECU_Sheet4.SchDoc
size A3
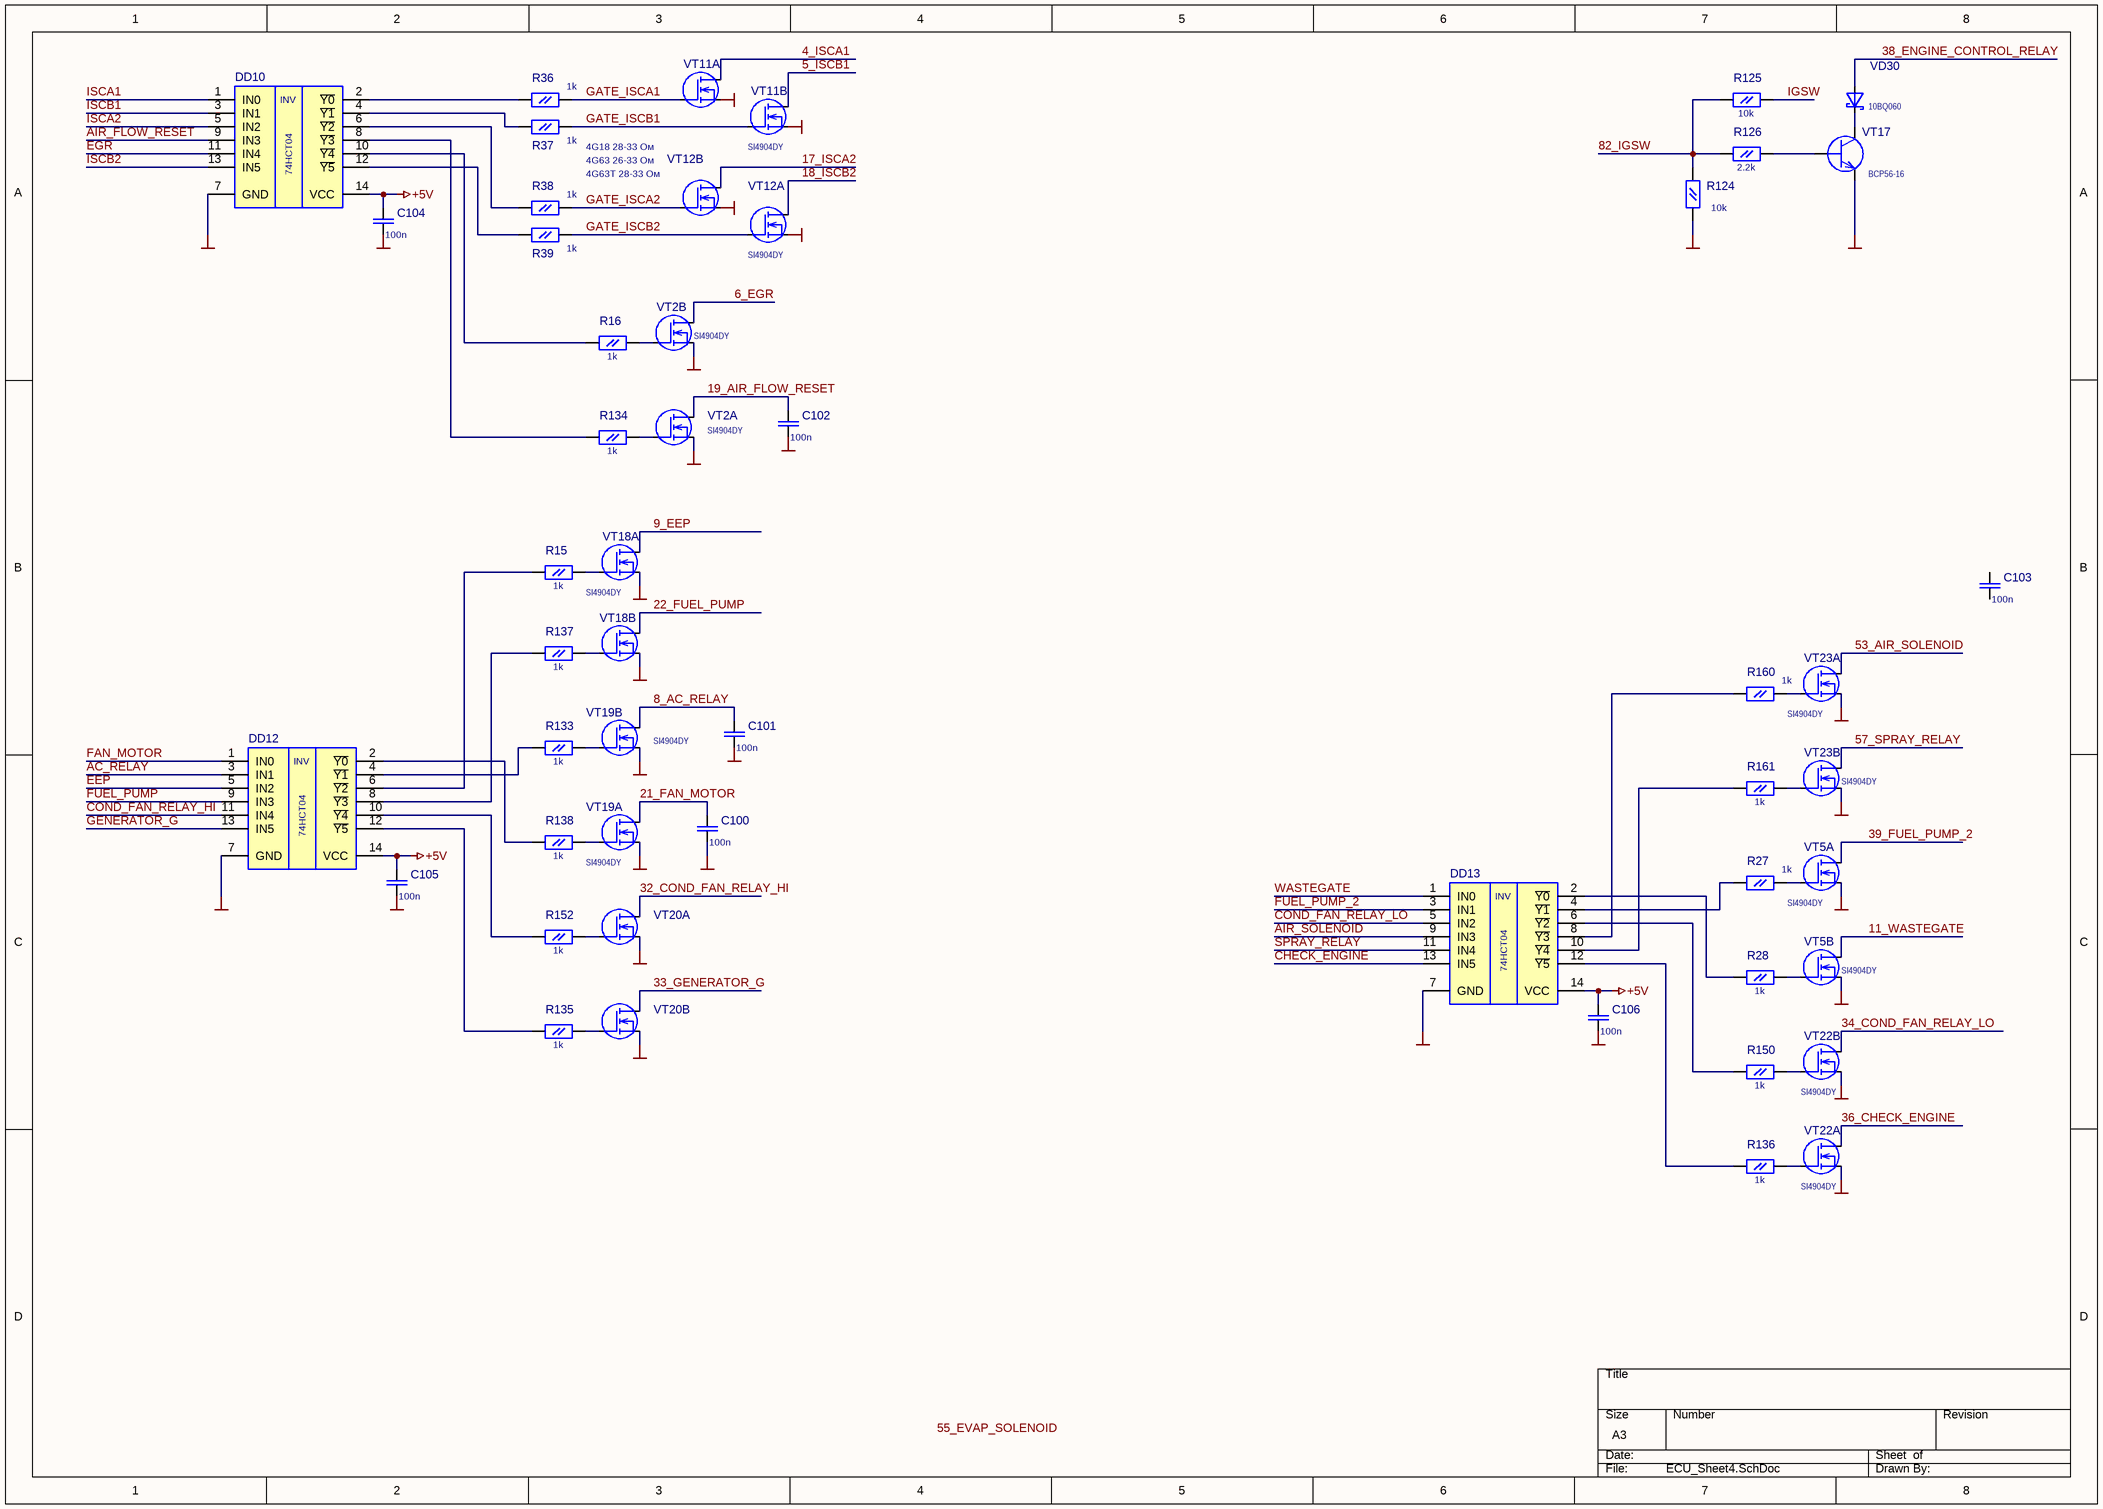
[diagram p3: ECU_Sheet4.SchDoc]

### Parts
C100  value 100n  [C0805L]  (hidden comment: CSMD)
C101  value 100n  [C0805L]  (hidden comment: CSMD)
C102  value 100n  [C0805L]  (hidden comment: CSMD)
C103  value 100n  [C0805L]  (hidden comment: CSMD)
C104  value 100n  [C0805L]  (hidden comment: 0.1мкФ-25В-X8R-10%)
C105  value 100n  [C0805L]  (hidden comment: 0.1мкФ-25В-X8R-10%)
C106  value 100n  [C0805L]  (hidden comment: 0.1мкФ-25В-X8R-10%)
DD10  74HCT04  [TSSOP14 (JEDEC MO-153)]
DD12  74HCT04  [TSSOP14 (JEDEC MO-153)]
DD13  74HCT04  [TSSOP14 (JEDEC MO-153)]
R15  value 1k  [R0805L]  (hidden comment: RSMD)
R16  value 1k  [R0805L]  (hidden comment: RSMD)
R27  value 1k  [R0805L]  (hidden comment: RSMD)
R28  value 1k  [R0805L]  (hidden comment: RSMD)
R36  value 1k  [R0805L]  (hidden comment: RSMD)
R37  value 1k  [R0805L]  (hidden comment: RSMD)
R38  value 1k  [R0805L]  (hidden comment: RSMD)
R39  value 1k  [R0805L]  (hidden comment: RSMD)
R124  value 10k  [R0805L]  (hidden comment: RSMD)
R125  value 10k  [R0805L]  (hidden comment: RSMD)
R126  value 2.2k  [R0805L]  (hidden comment: RSMD)
R133  value 1k  [R0805L]  (hidden comment: RSMD)
R134  value 1k  [R0805L]  (hidden comment: RSMD)
R135  value 1k  [R0805L]  (hidden comment: RSMD)
R136  value 1k  [R0805L]  (hidden comment: RSMD)
R137  value 1k  [R0805L]  (hidden comment: RSMD)
R138  value 1k  [R0805L]  (hidden comment: RSMD)
R150  value 1k  [R0805L]  (hidden comment: RSMD)
R152  value 1k  [R0805L]  (hidden comment: RSMD)
R160  value 1k  [R0805L]  (hidden comment: RSMD)
R161  value 1k  [R0805L]  (hidden comment: RSMD)
VD30  10BQ060  [DO-214AA SMB]
VT2  SI4904DY  [SOIC8 DBL FET]  (parts A,B of 2)
VT5  SI4904DY  [SOIC8 DBL FET]  (parts A,B of 2)
VT11  SI4904DY  [SOIC8 DBL FET]  (value not drawn)  (parts A,B of 2)
VT12  SI4904DY  [SOIC8 DBL FET]  (parts A,B of 2)
VT17  BCP56-16  [SOT-223 PWR]
VT18  SI4904DY  [SOIC8 DBL FET]  (parts A,B of 2)
VT19  SI4904DY  [SOIC8 DBL FET]  (parts A,B of 2)
VT20  SI4904DY  [SOIC8 DBL FET]  (value not drawn)  (parts A,B of 2)
VT22  SI4904DY  [SOIC8 DBL FET]  (parts A,B of 2)
VT23  SI4904DY  [SOIC8 DBL FET]  (parts A,B of 2)

### Nets
+5V: C104.1 C105.1 C106.1 DD10.14(VCC) DD12.14(VCC) DD13.14(VCC)
GND: C100.2 C101.2 C102.2 C104.2 C105.2 C106.2 DD10.7(GND) DD12.7(GND) DD13.7(GND) R124.1(Pin1) VT2.1 VT2.3 VT5.1 VT5.3 VT11.1 VT11.3 VT12.1 VT12.3 VT17.3(E) VT18.1 VT18.3 VT19.1 VT19.3 VT20.1 VT20.3 VT22.1 VT22.3 VT23.1 VT23.3
4_ISCA1: VT11.6
5_ISCB1: VT11.5
6_EGR: VT2.5
8_AC_RELAY: C101.1 VT19.5
9_EEP: VT18.6
11_WASTEGATE: VT5.5
17_ISCA2: VT12.5
18_ISCB2: VT12.6
19_AIR_FLOW_RESET: C102.1 VT2.6
21_FAN_MOTOR: C100.1 VT19.6
22_FUEL_PUMP: VT18.5
32_COND_FAN_RELAY_HI: VT20.6
33_GENERATOR_G: VT20.5
34_COND_FAN_RELAY_LO: VT22.5
36_CHECK_ENGINE: VT22.6
38_ENGINE_CONTROL_RELAY: VD30.1
39_FUEL_PUMP_2: VT5.6
53_AIR_SOLENOID: VT23.6
57_SPRAY_RELAY: VT23.5
82_IGSW: R124.2(Pin2) R125.1(Pin1) R126.1(Pin1)
AC_RELAY: DD12.3(IN1)
AIR_FLOW_RESET: DD10.9(IN3)
AIR_SOLENOID: DD13.9(IN3)
CHECK_ENGINE: DD13.13(IN5)
COND_FAN_RELAY_HI: DD12.11(IN4)
COND_FAN_RELAY_LO: DD13.5(IN2)
EEP: DD12.5(IN2)
EGR: DD10.11(IN4)
FAN_MOTOR: DD12.1(IN0)
FUEL_PUMP: DD12.9(IN3)
FUEL_PUMP_2: DD13.3(IN1)
GATE_ISCA1: R36.2(Pin2) VT11.2
GATE_ISCA2: R38.2(Pin2) VT12.4
GATE_ISCB1: R37.2(Pin2) VT11.4
GATE_ISCB2: R39.2(Pin2) VT12.2
GENERATOR_G: DD12.13(IN5)
IGSW: R125.2(Pin2)
ISCA1: DD10.1(IN0)
ISCA2: DD10.5(IN2)
ISCB1: DD10.3(IN1)
ISCB2: DD10.13(IN5)
SPRAY_RELAY: DD13.11(IN4)
WASTEGATE: DD13.1(IN0)
NetDD10_2: DD10.2(~{Y0}) R36.1(Pin1)
NetDD10_4: DD10.4(~{Y1}) R37.1(Pin1)
NetDD10_6: DD10.6(~{Y2}) R38.1(Pin1)
NetDD10_8: DD10.8(~{Y3}) R134.1(Pin1)
NetDD10_10: DD10.10(~{Y4}) R16.1(Pin1)
NetDD10_12: DD10.12(~{Y5}) R39.1(Pin1)
NetDD12_2: DD12.2(~{Y0}) R138.1(Pin1)
NetDD12_4: DD12.4(~{Y1}) R133.1(Pin1)
NetDD12_6: DD12.6(~{Y2}) R15.1(Pin1)
NetDD12_8: DD12.8(~{Y3}) R137.1(Pin1)
NetDD12_10: DD12.10(~{Y4}) R152.1(Pin1)
NetDD12_12: DD12.12(~{Y5}) R135.1(Pin1)
NetDD13_2: DD13.2(~{Y0}) R28.1(Pin1)
NetDD13_4: DD13.4(~{Y1}) R27.1(Pin1)
NetDD13_6: DD13.6(~{Y2}) R150.1(Pin1)
NetDD13_8: DD13.8(~{Y3}) R160.1(Pin1)
NetDD13_10: DD13.10(~{Y4}) R161.1(Pin1)
NetDD13_12: DD13.12(~{Y5}) R136.1(Pin1)
NetR15_2: R15.2(Pin2) VT18.2
NetR16_2: R16.2(Pin2) VT2.4
NetR27_2: R27.2(Pin2) VT5.2
NetR28_2: R28.2(Pin2) VT5.4
NetR126_2: R126.2(Pin2) VT17.1(B)
NetR133_2: R133.2(Pin2) VT19.4
NetR134_2: R134.2(Pin2) VT2.2
NetR135_2: R135.2(Pin2) VT20.4
NetR136_2: R136.2(Pin2) VT22.2
NetR137_2: R137.2(Pin2) VT18.4
NetR138_2: R138.2(Pin2) VT19.2
NetR150_2: R150.2(Pin2) VT22.4
NetR152_2: R152.2(Pin2) VT20.2
NetR160_2: R160.2(Pin2) VT23.2
NetR161_2: R161.2(Pin2) VT23.4
NetVD30_2: VD30.2 VT17.2(C)

Not connected (* = marked no-connect by the designer): C103 1 2

### Notes on the sheet
- 4G18 28-33 Ом
- 4G63 26-33 Ом
- 4G63T 28-33 Ом
- Labels drawn without touching a wire or pin: 55_EVAP_SOLENOID
- (in symbol 74HCT04) INV

### Library data of the parts
C100-C106 = CSMD: C0603; Voltage: *; Part Field 1: *; Part Field 2: *
R15 R16 R27 R28 R36-R39 R124-R126 R133-R138 R150 R152 R160 R161 = RSMD: R0805
  R15 R16 R27 R28 R36-R39 R137 R138 R160 R161: Part Field 1: *; Part Field 2: *
VT2 VT5 VT11 VT12 VT18-VT20 VT22 VT23 = SQ9945BEY: SI4904DY или IRF7341TRPBF или SI4908DY
DD10 DD12 DD13 = 74HCT04: Part Field 1: *; Part Field 2: *
VD30 = 10BQ060: Value: *
VT17 = BCP56-16: Value: *

## Sheet ECU_Sheet5.SchDoc
size A3
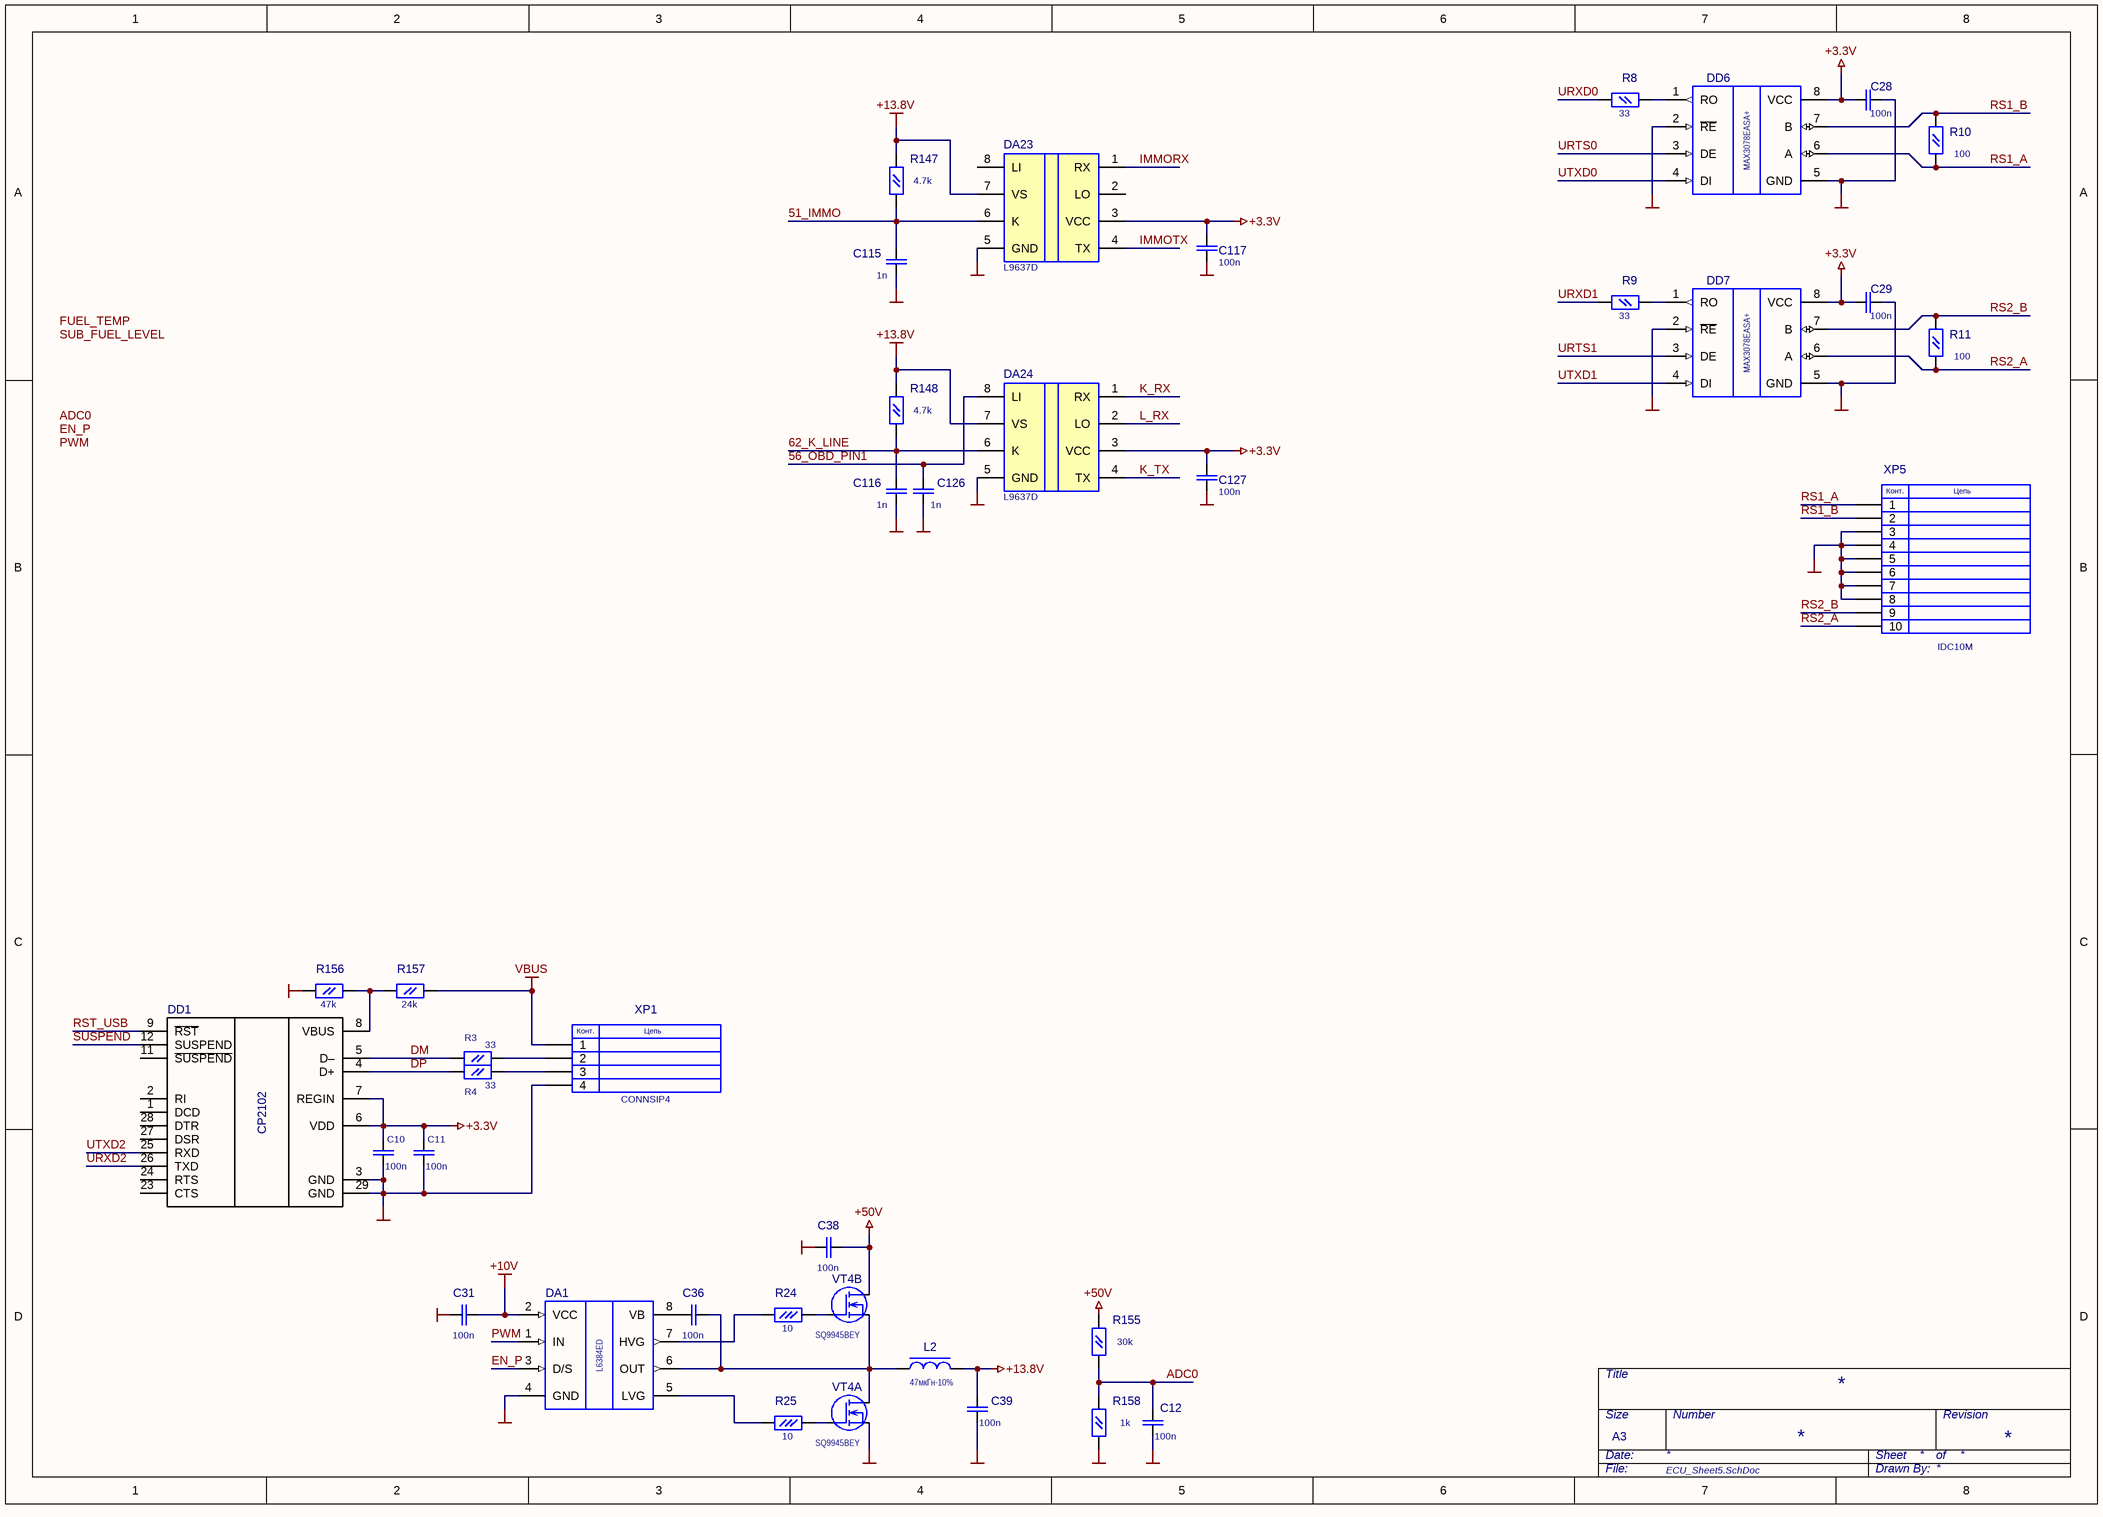
[diagram p4: ECU_Sheet5.SchDoc]

### Parts
C10  value 100n  [C0603L]  (hidden comment: CSMD)
C11  value 100n  [C0603L]  (hidden comment: CSMD)
C12  value 100n  [C0805L]  (hidden comment: 0.1мкФ-25В-X8R-10%)
C28  value 100n  [C0805L]  (hidden comment: 0.1мкФ-50В-X8R-10%)
C29  value 100n  [C0805L]  (hidden comment: 0.1мкФ-50В-X8R-10%)
C31  value 100n  [C0805L]  (hidden comment: CSMD)
C36  value 100n  [C0805L]  (hidden comment: CSMD)
C38  value 100n  [C0805L]  (hidden comment: CSMD)
C39  value 100n  [C0805L]  (hidden comment: 0.1мкФ-25В-X8R-10%)
C115  value 1n  [C0805L]  (hidden comment: CSMD)
C116  value 1n  [C0805L]  (hidden comment: CSMD)
C117  value 100n  [C0805L]  (hidden comment: 1мкФ-25В-X7R-10%)
C126  value 1n  [C0805L]  (hidden comment: CSMD)
C127  value 100n  [C0805L]  (hidden comment: 1мкФ-25В-X7R-10%)
DA1  L6384ED  [SOIC8 JEDEC]
DA23  L9637D  [SOIC8 JEDEC]
DA24  L9637D  [SOIC8 JEDEC]
DD1  CP2102  [QFN-28]
DD6  MAX3078EASA+  [SOIC8 JEDEC]
DD7  MAX3078EASA+  [SOIC8 JEDEC]
L2  47мкГн-10%  [L_SDR0604]
R3  value 33  [R0603L]  (hidden comment: RSMD)
R4  value 33  [R0603L]  (hidden comment: RSMD)
R8  value 33  [R0603L]  (hidden comment: 33-5%)
R9  value 33  [R0603L]  (hidden comment: 33-5%)
R10  value 100  [R0805L]  (hidden comment: 100-5%)
R11  value 100  [R0805L]  (hidden comment: 100-5%)
R24  value 10  [R0603L]  (hidden comment: 100-5%)
R25  value 10  [R0603L]  (hidden comment: 100-5%)
R147  value 4.7k  [R0805L]  (hidden comment: RSMD)
R148  value 4.7k  [R0805L]  (hidden comment: RSMD)
R155  value 30k  [R0805L]  (hidden comment: RSMD)
R156  value 47k  [R0805L]  (hidden comment: RSMD)
R157  value 24k  [R0805L]  (hidden comment: RSMD)
R158  value 1k  [R0805L]  (hidden comment: RSMD)
VT4  SQ9945BEY  [SOIC8 DBL FET]  (parts A,B of 2)
XP1  CONNSIP4  [SIP4]
XP5  IDC10M  [IDC10M]

### Nets
+3.3V: C10.2 C11.2 C28.1 C29.1 C117.2 C127.2 DA23.3(VCC) DA24.3(VCC) DD1.6(VDD) DD1.7(REGIN) DD6.8(VCC) DD7.8(VCC)
+10V: C31.1 DA1.2(VCC)
+13.8V: C39.1 DA23.7(VS) DA24.7(VS) L2.1 R147.2(Pin2) R148.2(Pin2)
+50V: C38.1 R155.2(Pin2) VT4.5
GND: C10.1 C11.1 C12.1 C28.2 C29.2 C31.2 C38.2 C39.2 C115.2 C116.2 C117.1 C126.2 C127.1 DA1.4(GND) DA23.5(GND) DA24.5(GND) DD1.3(GND) DD1.29(GND) DD6.2(~{RE}) DD6.5(GND) DD7.2(~{RE}) DD7.5(GND) R156.1(Pin1) R158.1(Pin1) VT4.1 XP1.4 XP5.3 XP5.4 XP5.5 XP5.6 XP5.7 XP5.8
VBUS: R157.2(Pin2) XP1.1
51_IMMO: C115.1 DA23.6(K) R147.1(Pin1)
56_OBD_PIN1: C126.1 DA24.8(LI)
62_K_LINE: C116.1 DA24.6(K) R148.1(Pin1)
ADC0: C12.2 R155.1(Pin1) R158.2(Pin2)
DM: DD1.5(D–) R3.1(Pin1)
DP: DD1.4(D+) R4.1(Pin1)
EN_P: DA1.3(D/S)
IMMORX: DA23.1(RX)
IMMOTX: DA23.4(TX)
K_RX: DA24.1(RX)
K_TX: DA24.4(TX)
L_RX: DA24.2(LO)
PWM: DA1.1(IN)
RS1_A: DD6.6(A) R10.1(Pin1) XP5.1
RS1_B: DD6.7(B) R10.2(Pin2) XP5.2
RS2_A: DD7.6(A) R11.1(Pin1) XP5.10
RS2_B: DD7.7(B) R11.2(Pin2) XP5.9
RST_USB: DD1.9(~{RST})
SUSPEND: DD1.12(SUSPEND)
URTS0: DD6.3(DE)
URTS1: DD7.3(DE)
URXD0: R8.2(Pin2)
URXD1: R9.2(Pin2)
URXD2: DD1.26(TXD)
UTXD0: DD6.4(DI)
UTXD1: DD7.4(DI)
UTXD2: DD1.25(RXD)
NetC36_1: C36.1 DA1.6(OUT) L2.2 VT4.3 VT4.6
NetC36_2: C36.2 DA1.8(VB)
NetDA1_5: DA1.5(LVG) R25.2
NetDA1_7: DA1.7(HVG) R24.2
NetDD1_8: DD1.8(VBUS) R156.2(Pin2) R157.1(Pin1)
NetDD6_1: DD6.1(RO) R8.1(Pin1)
NetDD7_1: DD7.1(RO) R9.1(Pin1)
NetR3_2: R3.2(Pin2) XP1.2
NetR4_2: R4.2(Pin2) XP1.3
NetR24_1: R24.1 VT4.4
NetR25_1: R25.1 VT4.2

Not connected (* = marked no-connect by the designer): DA23 2(LO) 8(LI); DD1 1(DCD) 2(RI) 10(NC) 11(~{SUSPEND}) 13(NC) 14(NC) 15(NC) 16(NC) 17(NC) 18(NC) 19(NC) 20(NC) 21(NC) 22(NC) 23(CTS) 24(RTS) 27(DSR) 28(DTR)

### Notes on the sheet
- Labels drawn without touching a wire or pin: ADC0, EN_P, FUEL_TEMP, PWM, SUB_FUEL_LEVEL
- Title
- Date:
- Size
- A3
- Number
- Sheet
- of
- Revision
- File:
- Drawn By:
- (in symbol CONNSIP4) Конт.; Цепь
- (in symbol IDC10M) Конт.; Цепь

### Library data of the parts
C10 C11 C28 C29 C31 C36 C38 C39 C115 C116 C126 = CSMD: C0603; Voltage: *; Part Field 1: *; Part Field 2: *
C12 = CSMD: C0603; Part Field 1: CGA3E2X8R1E104K080AA; Voltage: *; Part Field 2: *
C117 C127 = CSMD: C0603; Part Field 1: 0805; Voltage: *
DA23 DA24 = L9637: Monolithic bus driver with ISO 9141 interface; Part Field 1: *; Part Field 2: *
DD6 DD7 = MAX3088ESA: MAX3078EASA+ или ISL3179EFBZ или ADM3078EYRZ; Value: *
L2 = DROSSEL3: Part Field 1: SDR0604- 470KL
R3 R4 R8-R11 R24 R25 R147 R148 R155-R158 = RSMD: R0805
  R3 R4 R8-R11 R24 R25 R156 R157: Part Field 1: *; Part Field 2: *
XP1 = CONNSIP4: Value: *
XP5 = IDC10M: Value: *

## Sheet ECU_Sheet6.SchDoc
size A3
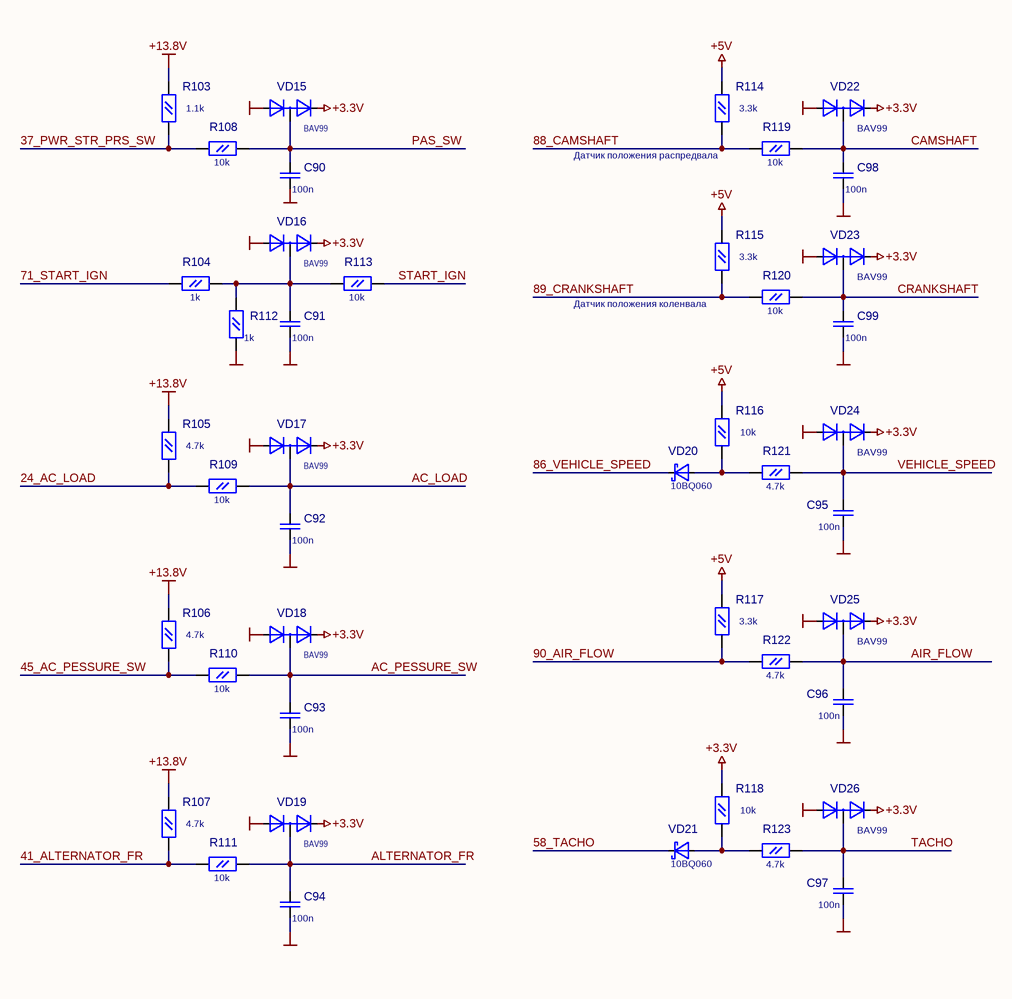
[diagram p5: ECU_Sheet6.SchDoc]

### Parts
C90  value 100n  [C0805L]  (hidden comment: CSMD)
C91  value 100n  [C0805L]  (hidden comment: CSMD)
C92  value 100n  [C0805L]  (hidden comment: CSMD)
C93  value 100n  [C0805L]  (hidden comment: CSMD)
C94  value 100n  [C0805L]  (hidden comment: CSMD)
C95  value 100n  [C0805L]  (hidden comment: CSMD)
C96  value 100n  [C0805L]  (hidden comment: CSMD)
C97  value 100n  [C0805L]  (hidden comment: CSMD)
C98  value 100n  [C0805L]  (hidden comment: CSMD)
C99  value 100n  [C0805L]  (hidden comment: CSMD)
R103  value 1.1k  [R0805L]  (hidden comment: RSMD)
R104  value 1k  [R0805L]  (hidden comment: RSMD)
R105  value 4.7k  [R0805L]  (hidden comment: RSMD)
R106  value 4.7k  [R0805L]  (hidden comment: RSMD)
R107  value 4.7k  [R0805L]  (hidden comment: RSMD)
R108  value 10k  [R0805L]  (hidden comment: RSMD)
R109  value 10k  [R0805L]  (hidden comment: RSMD)
R110  value 10k  [R0805L]  (hidden comment: RSMD)
R111  value 10k  [R0805L]  (hidden comment: RSMD)
R112  value 1k  [R0805L]  (hidden comment: RSMD)
R113  value 10k  [R0805L]  (hidden comment: RSMD)
R114  value 3.3k  [R0805L]  (hidden comment: RSMD)
R115  value 3.3k  [R0805L]  (hidden comment: RSMD)
R116  value 10k  [R0805L]  (hidden comment: RSMD)
R117  value 3.3k  [R0805L]  (hidden comment: RSMD)
R118  value 10k  [R0805L]  (hidden comment: RSMD)
R119  value 10k  [R0805L]  (hidden comment: RSMD)
R120  value 10k  [R0805L]  (hidden comment: RSMD)
R121  value 4.7k  [R0805L]  (hidden comment: RSMD)
R122  value 4.7k  [R0805L]  (hidden comment: RSMD)
R123  value 4.7k  [R0805L]  (hidden comment: RSMD)
VD15  BAV99  [SOT-23]
VD16  BAV99  [SOT-23]
VD17  BAV99  [SOT-23]
VD18  BAV99  [SOT-23]
VD19  BAV99  [SOT-23]
VD20  10BQ060  [DO-214AA SMB]
VD21  10BQ060  [DO-214AA SMB]
VD22  BAV99  [SOT-23]
VD23  BAV99  [SOT-23]
VD24  BAV99  [SOT-23]
VD25  BAV99  [SOT-23]
VD26  BAV99  [SOT-23]

### Nets
+3.3V: R118.2(Pin2) VD15.2(K) VD16.2(K) VD17.2(K) VD18.2(K) VD19.2(K) VD22.2(K) VD23.2(K) VD24.2(K) VD25.2(K) VD26.2(K)
+5V: R114.2(Pin2) R115.2(Pin2) R116.2(Pin2) R117.2(Pin2)
+13.8V: R103.2(Pin2) R105.2(Pin2) R106.2(Pin2) R107.2(Pin2)
GND: C90.2 C91.2 C92.2 C93.2 C94.2 C95.2 C96.2 C97.2 C98.2 C99.2 R112.1(Pin1) VD15.1(A) VD16.1(A) VD17.1(A) VD18.1(A) VD19.1(A) VD22.1(A) VD23.1(A) VD24.1(A) VD25.1(A) VD26.1(A)
24_AC_LOAD: R105.1(Pin1) R109.1(Pin1)
37_PWR_STR_PRS_SW: R103.1(Pin1) R108.1(Pin1)
41_ALTERNATOR_FR: R107.1(Pin1) R111.1(Pin1)
45_AC_PESSURE_SW: R106.1(Pin1) R110.1(Pin1)
58_TACHO: VD21.2
71_START_IGN: R104.1(Pin1)
86_VEHICLE_SPEED: VD20.2
88_CAMSHAFT: R114.1(Pin1) R119.1(Pin1)
89_CRANKSHAFT: R115.1(Pin1) R120.1(Pin1)
90_AIR_FLOW: R117.1(Pin1) R122.1(Pin1)
AC_LOAD: C92.1 R109.2(Pin2) VD17.3(C)
AC_PESSURE_SW: C93.1 R110.2(Pin2) VD18.3(C)
AIR_FLOW: C96.1 R122.2(Pin2) VD25.3(C)
ALTERNATOR_FR: C94.1 R111.2(Pin2) VD19.3(C)
CAMSHAFT: C98.1 R119.2(Pin2) VD22.3(C)
CRANKSHAFT: C99.1 R120.2(Pin2) VD23.3(C)
PAS_SW: C90.1 R108.2(Pin2) VD15.3(C)
START_IGN: R113.2(Pin2)
TACHO: C97.1 R123.2(Pin2) VD26.3(C)
VEHICLE_SPEED: C95.1 R121.2(Pin2) VD24.3(C)
NetC91_1: C91.1 R104.2(Pin2) R112.2(Pin2) R113.1(Pin1) VD16.3(C)
NetR116_1: R116.1(Pin1) R121.1(Pin1) VD20.1
NetR118_1: R118.1(Pin1) R123.1(Pin1) VD21.1

### Notes on the sheet
- (near R114) Датчик положения распредвала
- (near R115) Датчик положения коленвала
- Title
- Date:
- Size
- A3
- Number
- Sheet
- of
- Revision
- File:
- Drawn By:

### Library data of the parts
C90-C99 = CSMD: C0603; Voltage: *; Part Field 1: *; Part Field 2: *
R103-R123 = RSMD: R0805
VD15-VD19 VD22-VD26 = BAV99: Value: *
VD20 VD21 = 10BQ060: Value: *

## Nets that join several sheets
+3.3V: ECU_Sheet1 (26 pins), ECU_Sheet2 (DA20.2 DA20.4 R45.1), ECU_Sheet3 (5 pins), ECU_Sheet5 (12 pins), ECU_Sheet6 (11 pins)
+5V: ECU_Sheet1 (R154.2), ECU_Sheet2 (6 pins), ECU_Sheet3 (7 pins), ECU_Sheet4 (6 pins), ECU_Sheet6 (R114.2 R115.2 R116.2 R117.2)
+10V: ECU_Sheet2 (10 pins), ECU_Sheet3 (12 pins), ECU_Sheet5 (C31.1 DA1.2)
+13.8V: ECU_Sheet2 (14 pins), ECU_Sheet3 (R101.1), ECU_Sheet5 (6 pins), ECU_Sheet6 (R103.2 R105.2 R106.2 R107.2)
+50V: ECU_Sheet2 (VD7.2 VD8.2 VD9.2 VD10.2), ECU_Sheet5 (C38.1 R155.2 VT4.5)
GND: ECU_Sheet1 (46 pins), ECU_Sheet2 (31 pins), ECU_Sheet3 (81 pins), ECU_Sheet4 (29 pins), ECU_Sheet5 (32 pins), ECU_Sheet6 (21 pins)
4_ISCA1: ECU_Sheet2 (XP3.4), ECU_Sheet4 (VT11.6)
5_ISCB1: ECU_Sheet2 (XP3.5), ECU_Sheet4 (VT11.5)
6_EGR: ECU_Sheet2 (XP3.6), ECU_Sheet4 (VT2.5)
8_AC_RELAY: ECU_Sheet2 (XP3.8), ECU_Sheet4 (C101.1 VT19.5)
9_EEP: ECU_Sheet2 (XP3.9), ECU_Sheet4 (VT18.6)
11_WASTEGATE: ECU_Sheet2 (XP3.11), ECU_Sheet4 (VT5.5)
17_ISCA2: ECU_Sheet2 (XP3.17), ECU_Sheet4 (VT12.5)
18_ISCB2: ECU_Sheet2 (XP3.18), ECU_Sheet4 (VT12.6)
19_AIR_FLOW_RESET: ECU_Sheet2 (XP3.19), ECU_Sheet4 (C102.1 VT2.6)
21_FAN_MOTOR: ECU_Sheet2 (XP3.21), ECU_Sheet4 (C100.1 VT19.6)
22_FUEL_PUMP: ECU_Sheet2 (XP3.22), ECU_Sheet4 (VT18.5)
24_AC_LOAD: ECU_Sheet2 (XP3.24), ECU_Sheet6 (R105.1 R109.1)
32_COND_FAN_RELAY_HI: ECU_Sheet2 (XP3.32), ECU_Sheet4 (VT20.6)
33_GENERATOR_G: ECU_Sheet2 (XP3.33), ECU_Sheet4 (VT20.5)
34_COND_FAN_RELAY_LO: ECU_Sheet2 (XP3.34), ECU_Sheet4 (VT22.5)
36_CHECK_ENGINE: ECU_Sheet2 (XP3.36), ECU_Sheet4 (VT22.6)
37_PWR_STR_PRS_SW: ECU_Sheet2 (XP3.37), ECU_Sheet6 (R103.1 R108.1)
38_ENGINE_CONTROL_RELAY: ECU_Sheet2 (XP3.38), ECU_Sheet4 (VD30.1)
39_FUEL_PUMP_2: ECU_Sheet2 (XP3.39), ECU_Sheet4 (VT5.6)
41_ALTERNATOR_FR: ECU_Sheet2 (XP3.41), ECU_Sheet6 (R107.1 R111.1)
45_AC_PESSURE_SW: ECU_Sheet2 (XP3.45), ECU_Sheet6 (R106.1 R110.1)
51_IMMO: ECU_Sheet2 (XP3.51), ECU_Sheet5 (C115.1 DA23.6 R147.1)
53_AIR_SOLENOID: ECU_Sheet2 (XP3.53), ECU_Sheet4 (VT23.6)
54_O2HR: ECU_Sheet2 (XP3.54), ECU_Sheet3 (VT15.5)
56_OBD_PIN1: ECU_Sheet2 (XP3.56), ECU_Sheet5 (C126.1 DA24.8)
57_SPRAY_RELAY: ECU_Sheet2 (XP3.57), ECU_Sheet4 (VT23.5)
58_TACHO: ECU_Sheet2 (XP3.58), ECU_Sheet6 (VD21.2)
60_O2HF: ECU_Sheet2 (XP3.60), ECU_Sheet3 (VT15.6)
61_FUEL_TANK_DP: ECU_Sheet2 (XP3.61), ECU_Sheet3 (R77.2 R80.1)
62_K_LINE: ECU_Sheet2 (XP3.62), ECU_Sheet5 (C116.1 DA24.6 R148.1)
71_START_IGN: ECU_Sheet2 (XP3.71), ECU_Sheet6 (R104.1)
72_INTAKE_AIR_TEMP: ECU_Sheet2 (XP3.72), ECU_Sheet3 (C54.1 R53.1 R54.2 R59.1)
73_INLET_MAP2: ECU_Sheet2 (XP3.73), ECU_Sheet3 (R76.2 R79.1)
74_SUB_FUEL_LEVEL: ECU_Sheet2 (XP3.74), ECU_Sheet3 (R162.2 R164.1)
75_O2_SNSR: ECU_Sheet2 (XP3.75), ECU_Sheet3 (R48.2 R50.1)
76_O2_SNSF: ECU_Sheet2 (XP3.76), ECU_Sheet3 (R49.2 R51.1)
77_FUEL_TEMP: ECU_Sheet2 (XP3.77), ECU_Sheet3 (R163.2 R165.1)
78_KNOCK: ECU_Sheet2 (XP3.78), ECU_Sheet3 (C87.2)
80_BATTERY: ECU_Sheet1 (C119.1 C120.1 DA12.3), ECU_Sheet2 (XP3.80)
82_IGSW: ECU_Sheet2 (XP3.82), ECU_Sheet4 (R124.2 R125.1 R126.1)
83_ENGINE_COOLANT_TEMP: ECU_Sheet2 (XP3.83), ECU_Sheet3 (C55.1 R55.1 R56.2 R60.1)
84_THROTTLE_POS: ECU_Sheet2 (XP3.84), ECU_Sheet3 (R52.2 R58.1)
85_INLET_MAP: ECU_Sheet2 (XP3.85), ECU_Sheet3 (C56.1 R57.2 R61.1)
86_VEHICLE_SPEED: ECU_Sheet2 (XP3.86), ECU_Sheet6 (VD20.2)
88_CAMSHAFT: ECU_Sheet2 (XP3.88), ECU_Sheet6 (R114.1 R119.1)
89_CRANKSHAFT: ECU_Sheet2 (XP3.89), ECU_Sheet6 (R115.1 R120.1)
90_AIR_FLOW: ECU_Sheet2 (XP3.90), ECU_Sheet6 (R117.1 R122.1)
AC_LOAD: ECU_Sheet1 (DD11.70), ECU_Sheet6 (C92.1 R109.2 VD17.3)
AC_PESSURE_SW: ECU_Sheet1 (DD11.112), ECU_Sheet6 (C93.1 R110.2 VD18.3)
CAMSHAFT: ECU_Sheet1 (DD11.93), ECU_Sheet6 (C98.1 R119.2 VD22.3)
COND_FAN_RELAY_HI: ECU_Sheet1 (DD11.92), ECU_Sheet4 (DD12.11)
COND_FAN_RELAY_LO: ECU_Sheet1 (DD11.109), ECU_Sheet4 (DD13.5)
CRANKSHAFT: ECU_Sheet1 (DD11.99), ECU_Sheet6 (C99.1 R120.2 VD23.3)
EEP: ECU_Sheet1 (DD11.90), ECU_Sheet4 (DD12.5)
EGR: ECU_Sheet1 (DD11.131), ECU_Sheet4 (DD10.11)
EN_HIP: ECU_Sheet1 (DD11.59), ECU_Sheet3 (DD9.8)
EN_IGN14: ECU_Sheet1 (DD11.100), ECU_Sheet2 (DA9.3)
EN_IGN23: ECU_Sheet1 (DD11.103), ECU_Sheet2 (DA10.3)
ENGINE_COOLANT_TEMP: ECU_Sheet1 (DD11.24), ECU_Sheet3 (C70.1 R69.2 R73.2)
FAN_MOTOR: ECU_Sheet1 (DD11.101), ECU_Sheet4 (DD12.1)
FUEL_PUMP: ECU_Sheet1 (DD11.86), ECU_Sheet4 (DD12.9)
FUEL_TANK_DP: ECU_Sheet1 (DD11.18), ECU_Sheet3 (C84.1 R94.2 R97.2)
I_O2F: ECU_Sheet1 (DD11.15), ECU_Sheet3 (C133.1 DA19.1 R98.2)
I_O2R: ECU_Sheet1 (DD11.14), ECU_Sheet3 (C134.1 DA19.7 R95.2)
IGSW: ECU_Sheet1 (DD11.37), ECU_Sheet4 (R125.2)
INLET_MAP: ECU_Sheet1 (DD11.22), ECU_Sheet3 (C72.1 R71.2 R75.2)
INLET_MAP2: ECU_Sheet1 (DD11.19), ECU_Sheet3 (C83.1 R93.2 R96.2)
INT_HOLD: ECU_Sheet1 (DD11.118), ECU_Sheet3 (R78.1)
INTAKE_AIR_TEMP: ECU_Sheet1 (DD11.31), ECU_Sheet3 (C69.1 R68.2 R72.2)
ISCA1: ECU_Sheet1 (DD11.125), ECU_Sheet4 (DD10.1)
ISCA2: ECU_Sheet1 (DD11.126), ECU_Sheet4 (DD10.5)
ISCB1: ECU_Sheet1 (DD11.119), ECU_Sheet4 (DD10.3)
ISCB2: ECU_Sheet1 (DD11.121), ECU_Sheet4 (DD10.13)
K_RX: ECU_Sheet1 (DD11.32), ECU_Sheet5 (DA24.1)
K_TX: ECU_Sheet1 (DD11.105), ECU_Sheet5 (DA24.4)
KNOCK: ECU_Sheet1 (DD11.17), ECU_Sheet3 (C73.1 R81.2 R84.1)
L_RX: ECU_Sheet1 (DD11.141), ECU_Sheet5 (DA24.2)
PAS_SW: ECU_Sheet1 (DD11.129), ECU_Sheet6 (C90.1 R108.2 VD15.3)
SPRAY_RELAY: ECU_Sheet1 (DD11.110), ECU_Sheet4 (DD13.11)
START_IGN: ECU_Sheet1 (DD11.116), ECU_Sheet6 (R113.2)
TACHO: ECU_Sheet1 (DD11.16), ECU_Sheet6 (C97.1 R123.2 VD26.3)
THROTTLE_POS: ECU_Sheet1 (DD11.23), ECU_Sheet3 (C71.1 R70.2 R74.2)
URTS0: ECU_Sheet1 (DD11.114), ECU_Sheet5 (DD6.3)
URTS1: ECU_Sheet1 (DD11.91), ECU_Sheet5 (DD7.3)
URXD0: ECU_Sheet1 (DD11.75), ECU_Sheet5 (R8.2)
URXD1: ECU_Sheet1 (DD11.73), ECU_Sheet5 (R9.2)
URXD2: ECU_Sheet1 (DD11.52), ECU_Sheet5 (DD1.26)
UTXD0: ECU_Sheet1 (DD11.66), ECU_Sheet5 (DD6.4)
UTXD1: ECU_Sheet1 (DD11.77), ECU_Sheet5 (DD7.4)
UTXD2: ECU_Sheet1 (DD11.53), ECU_Sheet5 (DD1.25)
WASTEGATE: ECU_Sheet1 (DD11.1), ECU_Sheet4 (DD13.1)